# EAGLE design Gateway v2 (EAGLE 9.5.0)
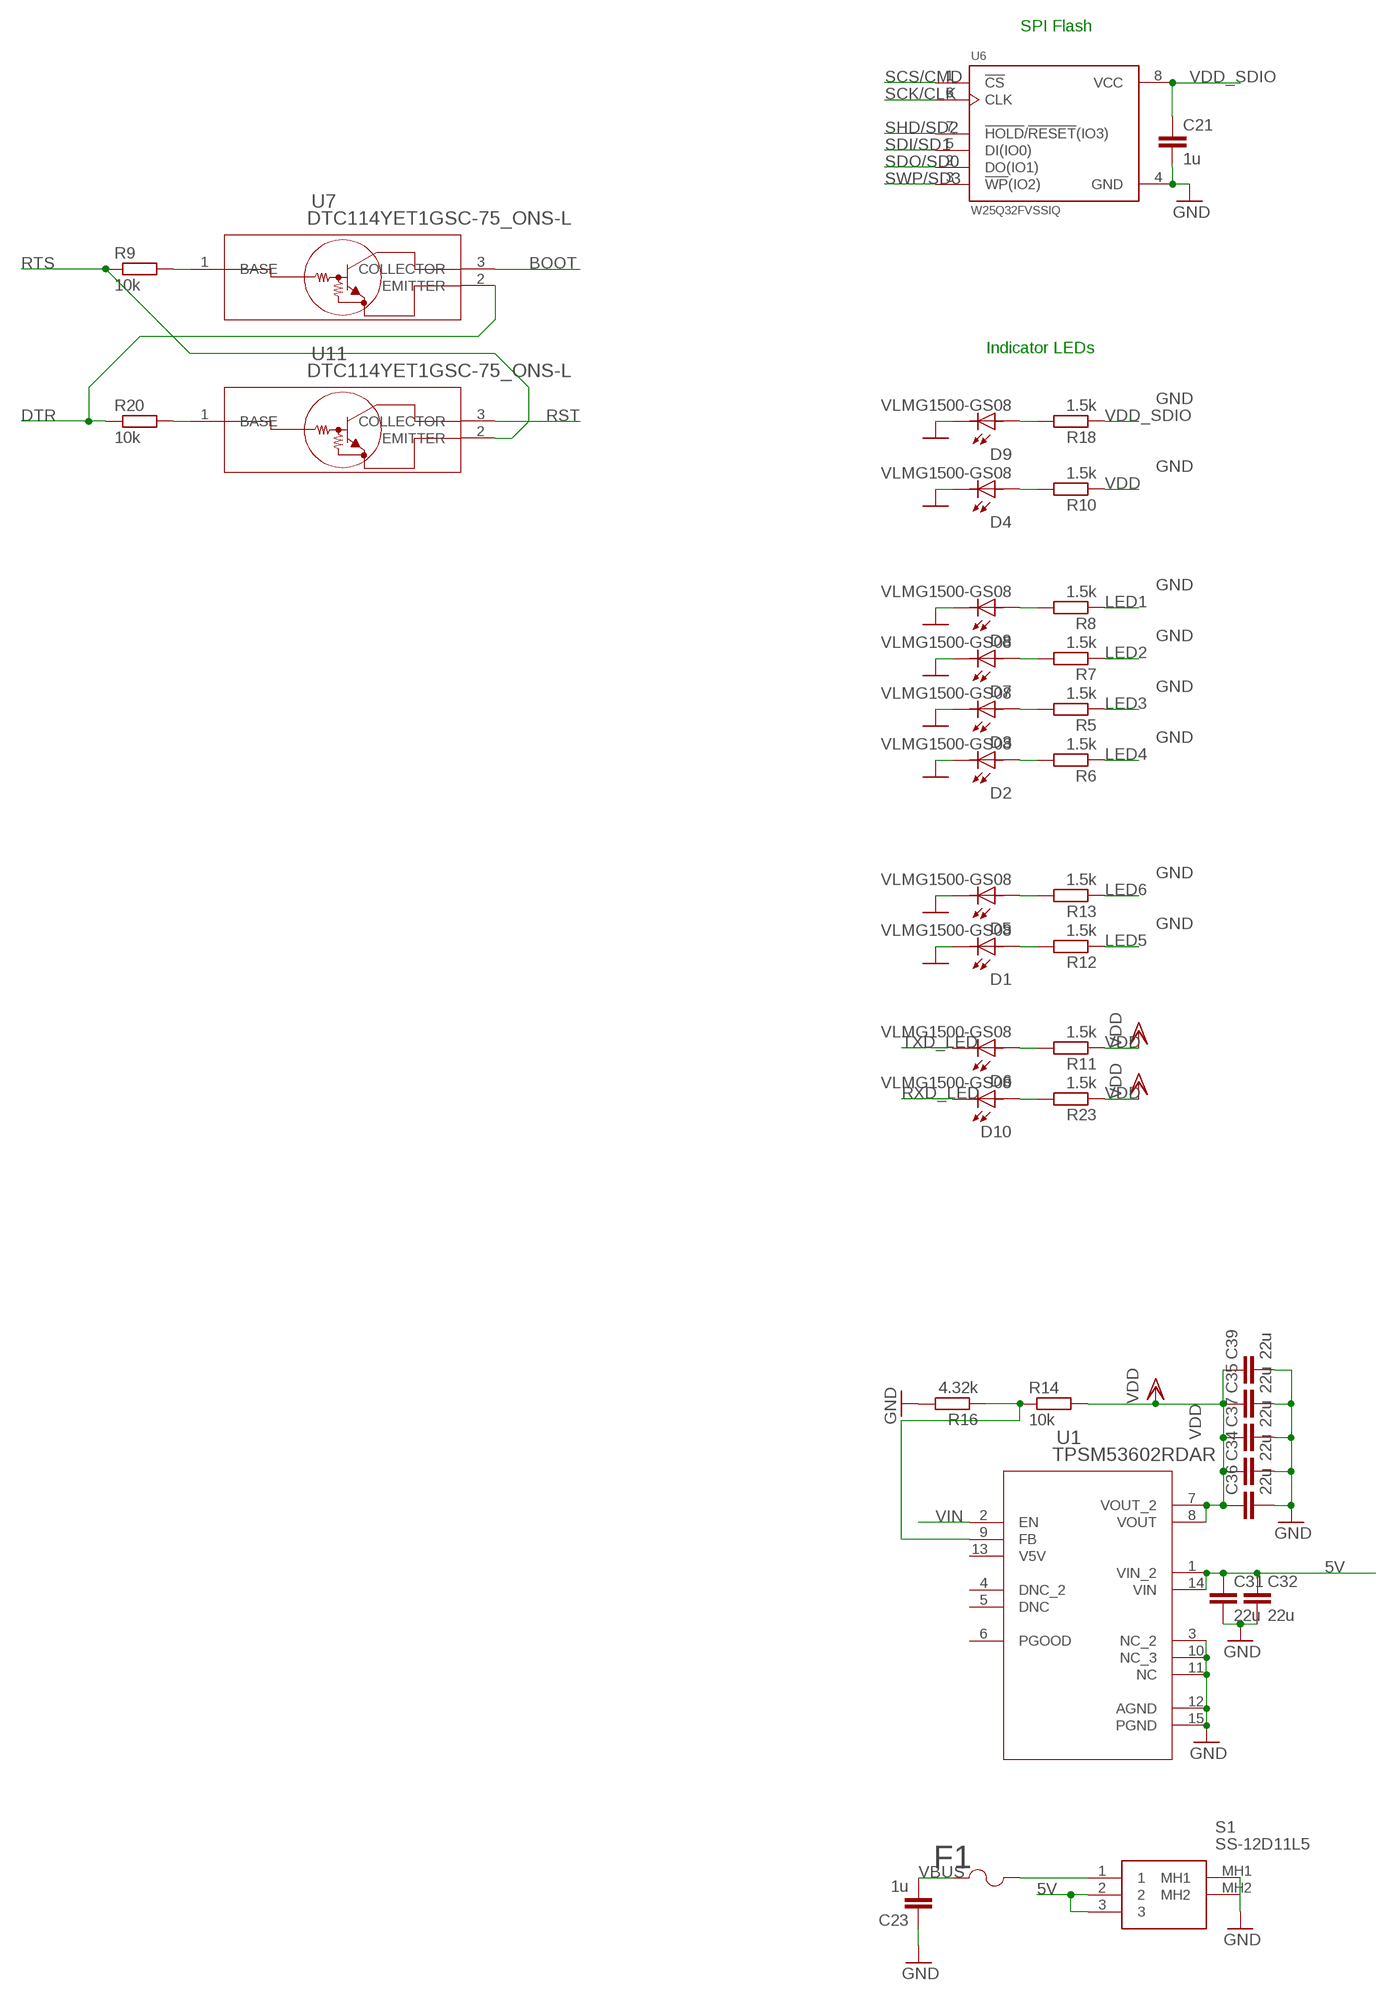
[diagram p0: schematic, sheet 1, part 1 of 2]
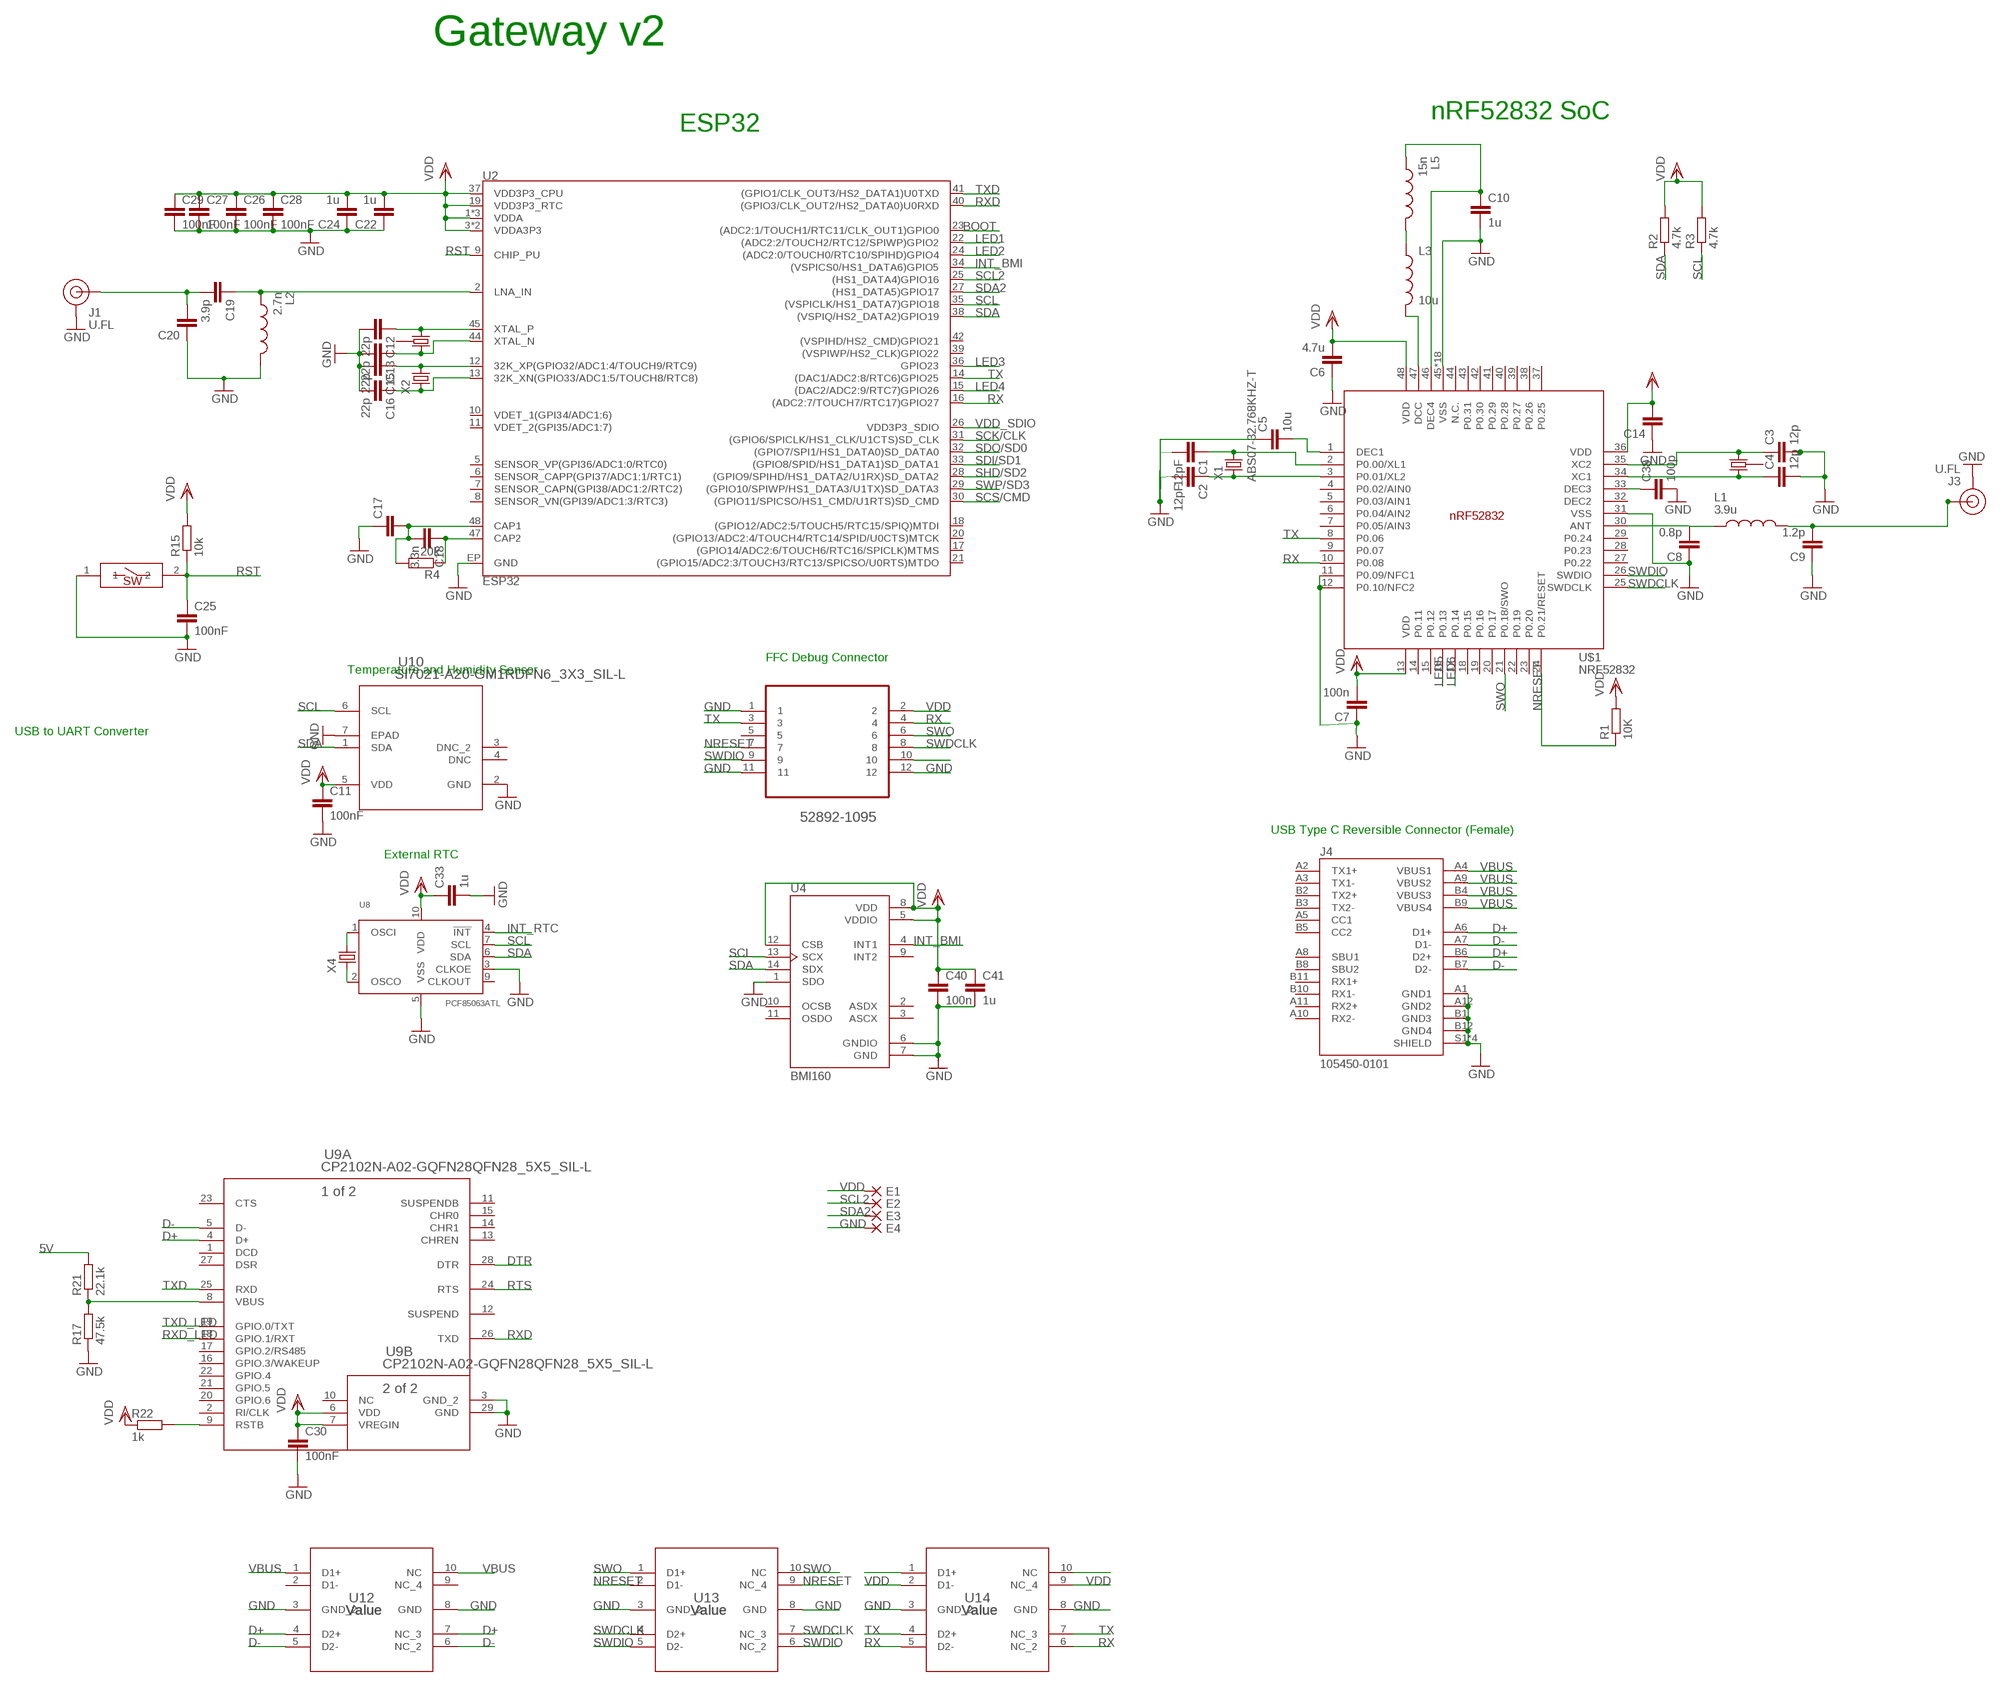
[diagram p1: schematic, sheet 1, part 2 of 2]

## Parts
C1  12pF  CC0402  [C0402]
C2  12pF  CC0402  [C0402]
C3  12p  CC0402  [C0402]
C4  12p  CC0402  [C0402]
C5  10u  CC0402  [C0402]
C6  4.7u  CC0402  [C0402]
C7  100n  CC0402  [C0402]
C8  0.8p  CC0402  [C0402]
C9  1.2p  CC0402  [C0402]
C10  1u  CC0402  [C0402]
C11  100nF  CC0402  [C0402]
C12  22p  CC0402  [C0402]
C13  22p  CC0402  [C0402]
C14  100u  CC0402  [C0402]
C15  22p  CC0402  [C0402]
C16  22p  CC0402  [C0402]
C17  10n  CC0402  [C0402]
C18  3.3n  CC0402  [C0402]
C19  3.9p  CC0402  [C0402]
C20  2.4p  CC0402  [C0402]
C21  1u  CC0402  [C0402]
C22  1u  CC0603R  [C0603R]
C23  1u  CC0603R  [C0603R]
C24  1u  CC0603R  [C0603R]
C25  100nF  CC0402  [C0402]
C26  100nF  CC0402  [C0402]
C27  100nF  CC0402  [C0402]
C28  100nF  CC0402  [C0402]
C29  100nF  CC0402  [C0402]
C30  100nF  CC0402  [C0402]
C31  22u  CC0603R  [C0603R]
C32  22u  CC0603R  [C0603R]
C33  1u  CC0603R  [C0603R]
C34  22u  CC0603R  [C0603R]
C35  22u  CC0603R  [C0603R]
C36  22u  CC0603R  [C0603R]
C37  22u  CC0603R  [C0603R]
C38  100p  CC0402  [C0402]
C39  22u  CC0603R  [C0603R]
C40  100n  CC0402  [C0402]
C41  1u  CC0402  [C0402]
D1  VLMG1500-GS08  [LEDC1005X35N]
D2  VLMG1500-GS08  [LEDC1005X35N]
D3  VLMG1500-GS08  [LEDC1005X35N]
D4  VLMG1500-GS08  [LEDC1005X35N]
D5  VLMG1500-GS08  [LEDC1005X35N]
D6  VLMG1500-GS08  [LEDC1005X35N]
D7  VLMG1500-GS08  [LEDC1005X35N]
D8  VLMG1500-GS08  [LEDC1005X35N]
D9  VLMG1500-GS08  [LEDC1005X35N]
D10  VLMG1500-GS08  [LEDC1005X35N]
E1  DPADS_PAD-0400-S  [DPADS_0400-S]
E2  DPADS_PAD-0400-S  [DPADS_0400-S]
E3  DPADS_PAD-0400-S  [DPADS_0400-S]
E4  DPADS_PAD-0400-S  [DPADS_0400-S]
F1  1210L050YR1210LSERIES_LTF-L  [1210LSERIES_LTF-L]
J1  U.FL  U.FL2PIN  [U.FL]
J3  U.FL  U.FL2PIN  [U.FL]
J4  105450-0101  [MOLEX_105450-0101]
L1  3.9u  MHQ0402P7N5JT000  [INDC0402X26N]
L2  2.7n  MHQ0402P7N5JT000  [INDC0402X26N]
L3  10u  INDUCTOR  [L0603]
L5  15n  MHQ0402P7N5JT000  [INDC0402X26N]
R1  10K  RR0402  [R0402]
R2  4.7k  RR0402  [R0402]
R3  4.7k  RR0402  [R0402]
R4  20k  RR0402  [R0402]
R5  1.5k  RR0402  [R0402]
R6  1.5k  RR0402  [R0402]
R7  1.5k  RR0402  [R0402]
R8  1.5k  RR0402  [R0402]
R9  10k  RR0402  [R0402]
R10  1.5k  RR0402  [R0402]
R11  1.5k  RR0402  [R0402]
R12  1.5k  RR0402  [R0402]
R13  1.5k  RR0402  [R0402]
R14  10k  RR0402  [R0402]
R15  10k  RR0402  [R0402]
R16  4.32k  RR0402  [R0402]
R17  47.5k  RR0402  [R0402]
R18  1.5k  RR0402  [R0402]
R20  10k  RR0402  [R0402]
R21  22.1k  RR0402  [R0402]
R22  1k  RR0402  [R0402]
R23  1.5k  RR0402  [R0402]
RESET  SMDSWITCH  [RESC4217X170]
S1  SS-12D11L5  [SS12D11L5]
U1  TPSM53602RDAR  [B3QFN15_RDA_TEX]
U2  ESP32  [QFN48-0.4MM]
U4  BMI160  [PQFN50P300X250X88-14N]
U5  52892-1095  [MOLEX_52892-1095]
U6  W25Q32FVSSIQ  [SOIC127P790X216-8N]
U7  DTC114YET1GSC-75_ONS-L  [SC-75_ONS-L]
U8  PCF85063ATL  [SOT1197-1]
U9  CP2102N-A02-GQFN28QFN28_5X5_SIL-L  [QFN28_5X5_SIL-L]
U10  SI7021-A20-GM1RDFN6_3X3_SIL-L  [DFN6_3X3_SIL-L]
U11  DTC114YET1GSC-75_ONS-L  [SC-75_ONS-L]
U12  Value  ESD204DQAR  [DQA0010A]
U13  Value  ESD204DQAR  [DQA0010A]
U14  Value  ESD204DQAR  [DQA0010A]
U$1  NRF52832  [QFN40P600X600X90-48_N]
X1  ABS07-32.768KHZ-T  [ABS07-32.768KHZ-T]
X2  ABS07-32.768KHZ-T  [ABS07-32.768KHZ-T]
X4  ABS07-32.768KHZ-T  [ABS07-32.768KHZ-T]
Y1  CRYSTAL-26MHZSMD-3.2X2.5  [CRYSTAL-SMD-3.2X2.5MM]
Y2  CRYSTAL-26MHZSMD-3.2X2.5  [CRYSTAL-SMD-3.2X2.5MM]

## Nets
5V: C31.1 C32.1 R21.2 S1.2 S1.3 U1.1(VIN_2) U1.14(VIN)
BOOT: U2.23((ADC2:1/TOUCH1/RTC11/CLK_OUT1)GPIO0) U7.3(COLLECTOR)
D+: J4.A6(D1+) J4.B6(D2+) U9.4(A:D+) U12.4(D2+) U12.7(NC_3)
D-: J4.A7(D1-) J4.B7(D2-) U9.5(A:D-) U12.5(D2-) U12.6(NC_2)
DTR: R20.1 U7.2(EMITTER) U9.28(A:DTR)
GND: C1.2 C2.2 C3.2 C4.2 C5.1 C6.1 C7.1 C8.1 C9.1 C10.2 C11.2 C12.2 C13.2 C14.1 C15.2 C16.2 C17.1 C20.1 C21.2 C22.1 C23.1 C24.1 C25.2 C26.2 C27.2 C28.2 C29.2 C30.2 C31.2 C32.2 C33.2 C34.2 C35.2 C36.2 C37.2 C38.2 C39.2 C40.2 C41.2 D1.2 D2.2 D3.2 D4.2 D5.2 D7.2 D8.2 D9.2 E4.PAD(P) J1.1(GND) J1.2(GND) J3.1(GND) J3.2(GND) J4.A1(GND1) J4.A12(GND2) J4.B1(GND3) J4.B12(GND4) J4.S1(SHIELD) J4.S2(SHIELD) J4.S3(SHIELD) J4.S4(SHIELD) L2.2 R16.2 R17.1 RESET.1 S1.MH1 S1.MH2 U1.3(NC_2) U1.10(NC_3) U1.11(NC) U1.12(AGND) U1.15(PGND) U2.EP(GND) U4.1(SDO) U4.6(GNDIO) U4.7(GND) U5.1 U5.11 U5.12 U6.4(GND) U8.3(CLKOE) U8.5(VSS) U9.3(B:GND_2) U9.29(B:GND) U10.2(GND) U10.7(EPAD) U12.3(GND_2) U12.8(GND) U13.3(GND_2) U13.8(GND) U14.3(GND_2) U14.8(GND) U$1.11(P0.09/NFC1) U$1.12(P0.10/NFC2) U$1.31(VSS) U$1.45(VSS) U$1.PAD(VSS) U$1.PAD@VIA01(VSS) U$1.PAD@VIA02(VSS) U$1.PAD@VIA03(VSS) U$1.PAD@VIA04(VSS) U$1.PAD@VIA05(VSS) U$1.PAD@VIA06(VSS) U$1.PAD@VIA07(VSS) U$1.PAD@VIA08(VSS) U$1.PAD@VIA09(VSS) U$1.PAD@VIA10(VSS) U$1.PAD@VIA11(VSS) U$1.PAD@VIA12(VSS) U$1.PAD@VIA13(VSS) U$1.PAD@VIA14(VSS) U$1.PAD@VIA15(VSS) U$1.PAD@VIA16(VSS)
INT_BMI: U2.34((VSPICS0/HS1_DATA6)GPIO5) U4.4(INT1)
INT_RTC: U8.4(!INT!)
LED1: R8.1 U2.22((ADC2:2/TOUCH2/RTC12/SPIWP)GPIO2)
LED2: R7.1 U2.24((ADC2:0/TOUCH0/RTC10/SPIHD)GPIO4)
LED3: R5.1 U2.36(GPIO23)
LED4: R6.1 U2.15((DAC2/ADC2:9/RTC7)GPIO26)
LED5: R12.1 U$1.16(P0.13)
LED6: R13.1 U$1.17(P0.14)
N$1: C1.1 U$1.2(P0.00/XL1) X1.2
N$2: C2.1 U$1.3(P0.01/XL2) X1.1
N$3: C3.1 U$1.35(XC2) Y1.3
N$4: C4.1 U$1.34(XC1) Y1.1
N$5: C5.2 U$1.1(DEC1)
N$6: C8.2 L1.1 U$1.30(ANT)
N$7: C13.1 U2.44(XTAL_N) Y2.3
N$8: C12.1 U2.45(XTAL_P) Y2.1
N$9: L3.2 U$1.47(DCC)
N$10: L3.1 L5.2
N$11: C10.1 L5.1 U$1.46(DEC4)
N$12: C15.1 U2.12(32K_XP(GPIO32/ADC1:4/TOUCH9/RTC9)) X2.2
N$13: C16.1 U2.13(32K_XN(GPIO33/ADC1:5/TOUCH8/RTC8)) X2.1
N$14: C18.1 R4.1 U2.47(CAP2)
N$15: C38.1 U$1.33(DEC3)
N$16: C17.2 C18.2 R4.2 U2.48(CAP1)
N$18: D3.1 R5.2
N$19: D7.1 R7.2
N$20: D8.1 R8.2
N$21: U5.10
N$22: C19.1 L2.1 U2.2(LNA_IN)
N$23: R17.2 R21.1 U9.8(A:VBUS)
N$24: D2.1 R6.2
N$25: D4.1 R10.2
N$26: D1.1 R12.2
N$27: D5.1 R13.2
N$28: C19.2 C20.2 J1.FEED(SIGNAL)
N$29: R20.2 U11.1(BASE)
N$30: R9.2 U7.1(BASE)
N$31: D9.1 R18.2
N$32: R14.1 R16.1 U1.9(FB)
N$33: U8.1(OSCI) X4.2
N$34: U8.2(OSCO) X4.1
N$35: R22.2 U9.9(A:RSTB)
N$36: D6.1 R11.2
N$37: D10.1 R23.2
N$38: F1.2 S1.1
N$47: U14.10(NC)
NRESET: R1.1 U5.7 U13.2(D1-) U13.9(NC_4) U$1.24(P0.21/RESET)
RFP1: C9.2 J3.FEED(SIGNAL) L1.2
RST: C25.1 R15.1 RESET.2 U2.9(CHIP_PU) U11.3(COLLECTOR)
RTS: R9.1 U9.24(A:RTS) U11.2(EMITTER)
RX: U2.16((ADC2:7/TOUCH7/RTC17)GPIO27) U5.4 U14.5(D2-) U14.6(NC_2) U$1.10(P0.08)
RXD: U2.40((GPIO3/CLK_OUT2/HS2_DATA0)U0RXD) U9.26(A:TXD)
RXD_LED: D10.2 U9.18(A:GPIO.1/RXT)
SCK/CLK: U2.31((GPIO6/SPICLK/HS1_CLK/U1CTS)SD_CLK) U6.6(CLK)
SCL: R3.1 U2.35((VSPICLK/HS1_DATA7)GPIO18) U4.13(SCX) U8.7(SCL) U10.6(SCL)
SCL2: E2.PAD(P) U2.25((HS1_DATA4)GPIO16)
SCS/CMD: U2.30((GPIO11/SPICSO/HS1_CMD/U1RTS)SD_CMD) U6.1(!CS)
SDA: R2.1 U2.38((VSPIQ/HS2_DATA2)GPIO19) U4.14(SDX) U8.6(SDA) U10.1(SDA)
SDA2: E3.PAD(P) U2.27((HS1_DATA5)GPIO17)
SDI/SD1: U2.33((GPIO8/SPID/HS1_DATA1)SD_DATA1) U6.5(DI(IO0))
SDO/SD0: U2.32((GPIO7/SPI1/HS1_DATA0)SD_DATA0) U6.2(DO(IO1))
SHD/SD2: U2.28((GPIO9/SPIHD/HS1_DATA2/U1RX)SD_DATA2) U6.7(!HOLD!/!RESET!(IO3))
SWDCLK: U5.8 U13.4(D2+) U13.7(NC_3) U$1.25(SWDCLK)
SWDCLK1: U14.1(D1+)
SWDIO: U5.9 U13.5(D2-) U13.6(NC_2) U$1.26(SWDIO)
SWO: U5.6 U13.1(D1+) U13.10(NC) U$1.21(P0.18/SWO)
SWP/SD3: U2.29((GPIO10/SPIWP/HS1_DATA3/U1TX)SD_DATA3) U6.3(!WP!(IO2))
TX: U2.14((DAC1/ADC2:8/RTC6)GPIO25) U5.3 U14.4(D2+) U14.7(NC_3) U$1.8(P0.06)
TXD: U2.41((GPIO1/CLK_OUT3/HS2_DATA1)U0TXD) U9.25(A:RXD)
TXD_LED: D6.2 U9.19(A:GPIO.0/TXT)
VBUS: C23.2 F1.1 J4.A4(VBUS1) J4.A9(VBUS2) J4.B4(VBUS3) J4.B9(VBUS4) U12.1(D1+) U12.10(NC)
VDD: C6.2 C7.2 C11.1 C14.2 C22.2 C24.2 C26.1 C27.1 C28.1 C29.1 C30.1 C33.1 C34.1 C35.1 C36.1 C37.1 C39.1 C40.1 C41.1 E1.PAD(P) R1.2 R2.2 R3.2 R10.1 R11.1 R14.2 R15.2 R22.1 R23.1 U1.7(VOUT_2) U1.8(VOUT) U2.1(VDDA) U2.3(VDDA3P3) U2.4(VDDA3P3) U2.19(VDD3P3_RTC) U2.37(VDD3P3_CPU) U2.43(VDDA) U2.46(VDDA) U4.5(VDDIO) U4.8(VDD) U4.12(CSB) U5.2 U8.10(VDD) U9.6(B:VDD) U9.7(B:VREGIN) U10.5(VDD) U14.2(D1-) U14.9(NC_4) U$1.13(VDD) U$1.36(VDD) U$1.48(VDD)
VDD_SDIO: C21.1 R18.1 U2.26(VDD3P3_SDIO) U6.8(VCC)
VIN: U1.2(EN)
Unconnected: J4.A2(TX1+) J4.A3(TX1-) J4.A5(CC1) J4.A8(SBU1) J4.A10(RX2-) J4.A11(RX2+) J4.B2(TX2+) J4.B3(TX2-) J4.B5(CC2) J4.B8(SBU2) J4.B10(RX1-) J4.B11(RX1+) U1.4(DNC_2) U1.5(DNC) U1.6(PGOOD) U1.13(V5V) U2.5(SENSOR_VP(GPI36/ADC1:0/RTC0)) U2.6(SENSOR_CAPP(GPI37/ADC1:1/RTC1)) U2.7(SENSOR_CAPN(GPI38/ADC1:2/RTC2)) U2.8(SENSOR_VN(GPI39/ADC1:3/RTC3)) U2.10(VDET_1(GPI34/ADC1:6)) U2.11(VDET_2(GPI35/ADC1:7)) U2.17((GPIO14/ADC2:6/TOUCH6/RTC16/SPICLK)MTMS) U2.18((GPIO12/ADC2:5/TOUCH5/RTC15/SPIQ)MTDI) U2.20((GPIO13/ADC2:4/TOUCH4/RTC14/SPID/U0CTS)MTCK) U2.21((GPIO15/ADC2:3/TOUCH3/RTC13/SPICSO/U0RTS)MTDO) U2.39((VSPIWP/HS2_CLK)GPIO22) U2.42((VSPIHD/HS2_CMD)GPIO21) U4.2(ASDX) U4.3(ASCX) U4.9(INT2) U4.10(OCSB) U4.11(OSDO) U5.5 U8.9(CLKOUT) U9.1(A:DCD) U9.2(A:RI/CLK) U9.10(B:NC) U9.11(A:SUSPENDB) U9.12(A:SUSPEND) U9.13(A:CHREN) U9.14(A:CHR1) U9.15(A:CHR0) U9.16(A:GPIO.3/WAKEUP) U9.17(A:GPIO.2/RS485) U9.20(A:GPIO.6) U9.21(A:GPIO.5) U9.22(A:GPIO.4) U9.23(A:CTS) U9.27(A:DSR) U10.3(DNC_2) U10.4(DNC) U12.2(D1-) U12.9(NC_4) U$1.4(P0.02/AIN0) U$1.5(P0.03/AIN1) U$1.6(P0.04/AIN2) U$1.7(P0.05/AIN3) U$1.9(P0.07) U$1.14(P0.11) U$1.15(P0.12) U$1.18(P0.15) U$1.19(P0.16) U$1.20(P0.17) U$1.22(P0.19) U$1.23(P0.20) U$1.27(P0.22) U$1.28(P0.23) U$1.29(P0.24) U$1.32(DEC2) U$1.37(P0.25) U$1.38(P0.26) U$1.39(P0.27) U$1.40(P0.28) U$1.41(P0.29) U$1.42(P0.30) U$1.43(P0.31) U$1.44(N.C.) Y1.2 Y1.4 Y2.2 Y2.4

## Notes on the sheet
- Gateway v2
- nRF52832 SoC
- ESP32
- SPI Flash
- Indicator LEDs
- FFC Debug Connector
- Temperature and Humidity Sensor
- USB to UART Converter
- USB Type C Reversible Connector (Female)
- External RTC

## Library data of the parts
C1-C21 C25-C30 C38 C40 C41 = eagle-ltspice:C: CAPACITOR, European symbol; SPICEMODEL: NONE; SPICEPREFIX: C
C22-C24 C31-C37 C39 = eagle-ltspice:C: CAPACITOR, European symbol
D1-D10 = VLMG1500-GS08:VLMG1500-GS08: 0402 GREEN 571nm 35MCD 65° Rectangle with Flat Top SMT LED; AVAILABILITY: Unavailable; DESCRIPTION: 0402 GREEN 571nm 35MCD 65° Rectangle with Flat Top SMT LED; MF: Vishay; MP: VLMG1500-GS08; PACKAGE: 0402 Vishay; PRICE: None
E1-E4 = 52101-101-REV-A:DPADS_PAD: WIRE PAD Standard US Drill Sizes and SMD pads; BOM: EXCLUDE
F1 = 1210 FUSE:1210L050YR; BUILT_BY: EMA_UL_Team; MANUFACTURER_PART_NUMBER: 1210L050YR; SOURCELIBRARY: LittleFuse_2015-04-13; VENDOR: Littelfuse Inc
J1 J3 = SparkFun-Connectors:U.FL2PIN: SMD Antenna Connector - U.FL 2mm height, 3.0mm x 3.0mm receptacle size. SparkFun Products: SparkFun WiFi Shield - ESP8266 <https://www.sparkfun.com/products/13287> SparkFun ESP8266 Thing <https://www.sparkfun.com/products/13231> SparkFun MiniGen - Pro Mini Signal Generator Shield <https://www.sparkfun.com/products/11420>; PROD_ID: CONN-09193; SF_ID: WRL-09144
J4 = 105450-0101:105450-0101: USB Shielded I/O Receptacle; Type C; Right Angle; Surface Mount; Gold over Nickel; AVAILABILITY: Unavailable; DESCRIPTION: USB-C (USB TYPE-C) USB 3.1 (USB 3.1 Gen 2, Superspeed+) Receptacle Connector 24 Position Surface Mount, Right Angle; Through Hole; MF: Molex; MP: 1054500101; PACKAGE: None; PRICE: None
L1 L2 L5 = MHQ0402P7N5JT000:MHQ0402P7N5JT000: 221 NH 5% GOLD TERMINAL; AVAILABILITY: Unavailable; DESCRIPTION: FIXED IND 7.5NH 200MA 1.2 OHM; MF: TDK; MP: MHQ0402P7N5JT000; PACKAGE: 0402 TDK; PRICE: None
L3 = BeagleBone_Blue_R3:INDUCTOR: Inductors Basic Inductor/Choke - 0603 and 1206. Footprints are not proven and vary greatly between part numbers. SRN6045- 33uH, 20% 1.4A
R1-R18 R20-R23 = eagle-ltspice:R: RESISTOR, European symbol; SPICEMODEL: NONE; SPICEPREFIX: R
RESET = SMD SWITCH:SMDSWITCH
S1 = SS-12D11L5:SS-12D11L5: Toggle Switches DIP RoHS Source: Datasheet <https://datasheet.lcsc.com/szlcsc/XKB-SS-12D11L5_C319010.pdf>; ARROW_PART_NUMBER: SS-12D11L5; DESCRIPTION: Toggle Switches DIP RoHS; HEIGHT: 6.9mm; MANUFACTURER_NAME: XKB Enterprise; MANUFACTURER_PART_NUMBER: SS-12D11L5
U1 = TPSM53602:TPSM53602RDAR; BUILT_BY: EMA_Cory; COPYRIGHT: Copyright (C) 2018 Accelerated Designs. All rights reserved; DATASHEET: https://www.ti.com/lit/ds/symlink/tpsm53602.pdf?ts=1593032137197&ref_url=https%253A%252F%252Fwww.ti.com%252Fstore%252Fti%252Fen%252Fp%252Fproduct%252F%253Fp%253DTPSM53602RDAR; MANUFACTURER_PART_NUMBER: TPSM53602RDAR; SOURCELIBRARY: TI_2020-06-27; VENDOR: Texas Instruments
U2 = SparkFun-RF:ESP32: Espressif ESP32 WiFi-compatible SoC microcontroller. Bluetooth Low energy support (BLE, BT4.0, Bluetooth Smart) 28 GPIO pins Dual-core Tensilica LX6 microprocessor Hardware accelerated encryption (AES, SHA2, ECC, RSA-4096) 4MB Flash memory 520kB internal SRAM Datasheet <https://cdn.sparkfun.com/datasheets/IoT/esp32_datasheet_en.pdf> SparkFun Products: SparkFun ESP32 Thing <https://www.sparkfun.com/products/13907>; PROD_ID: IC-13338
U4 = BMI160:BMI160: BMI160 2.5 x 3 mm Tiaxial Accelerometer / Gyroscope Inertial Measurement Unit; AVAILABILITY: Unavailable; DESCRIPTION: BMI160 2.5 x 3 mm Tiaxial Accelerometer / Gyroscope Inertial Measurement Unit; MF: Bosch; MP: BMI160; PACKAGE: LGA-14 Bosch; PRICE: None
U5 = 52892-1095:52892-1095: CONNECTOR, FPC, ZIF, 0.50MM, 10 WAY; AVAILABILITY: Unavailable; DESCRIPTION: Socket, r/a, Fpc, Zif, Smt, 10way; MF: Molex; MP: 52892-1095; PACKAGE: None; PRICE: None
U6 = W25Q32FVSSIQ:W25Q32FVSSIQ: NOR Flash Serial-SPI 3V/3.3V 32M-bit 4M x 8 8.5ns 8-Pin SOIC; AVAILABILITY: Unavailable; DESCRIPTION: Flash Serial-SPI 3V 32Mbit 32M x 1bit 7ns 8-Pin SOIC Bulk; MF: Winbond Electronics; MP: W25Q32FVSSIQ; PACKAGE: SOIC-8 Winbond; PRICE: None
U7 U11 = DTC114YET1G:DTC114YET1G; BUILT_BY: EMA_Justin; COPYRIGHT: Copyright (C) 2018 Accelerated Designs. All rights reserved; DATASHEET: https://www.onsemi.com/pub/Collateral/DTC114Y-D.PDF; MANUFACTURER_PART_NUMBER: DTC114YET1G; SOURCELIBRARY: ON_Semiconductor_2020-01-13; VENDOR: ON Semiconductor
U8 = PCF85063ATL:PCF85063ATL: Tiny Real-Time Clock/calendar with alarm function and I2C-bus The PCF85063A is a CMOS1 Real-Time Clock (RTC) and calendar optimized for low power consumption. An offset register allows fine-tuning of the clock. All addresses and data are transferred serially via the two-line bidirectional I2C-bus. Maximum data rate is 400 kbit/s. The register address is incremented automatically after each written or read data byte. AAL Eindhoven MK; AVAILABILITY: Unavailable; DESCRIPTION: Real Time Clock _RTC_ IC Clock/Calendar I²C, 2-Wire Serial 10-XFDFN Exposed Pad; MF: NXP USA; MP: PCF85063ATL; PACKAGE: DFN-10 NXP Semiconductors; PRICE: None
U9 = CP2102N:CP2102N-A02-GQFN28; BUILT_BY: EMA_Cory; COPYRIGHT: Copyright (C) 2018 Accelerated Designs. All rights reserved; DATASHEET: https://www.silabs.com/documents/public/data-sheets/cp2102n-datasheet.pdf; MANUFACTURER_PART_NUMBER: CP2102N-A02-GQFN28; SOURCELIBRARY: Silicon_Labs_2020-02-14; VENDOR: Silicon Labs
U10 = SI7021:SI7021-A20-GM1R; BUILT_BY: EMA_Jessica; COPYRIGHT: Copyright (C) 2018 Accelerated Designs. All rights reserved; MANUFACTURER_PART_NUMBER: SI7021-A20-GM1R; SOURCELIBRARY: Silicon_Labs_2020-01-01; VENDOR: Silicon Labs
U12-U14 = ESD204DQAR:ESD204DQAR; MANUFACTURER: Texas Instruments; PARTNUMBER: ESD204DQAR; REFDES: RefDes; TYPE: TYPE
U$1 = Nordic_nRF:NRF52832: nRF52832 Features Single chip, highly flexible, 2.4 GHz multi-protocol SoC 32-bit ARM Cortex-M4F Processor 1.7v to 3.6v operation 512kB flash + 64kB RAM Supports concurrent Bluetooth Smart/ANT protocol operation On-chip NFC tag for Out-of-Band (OOB) pairing Up to +4dBm output power -96dBm sensitivity, Bluetooth Smart Thread safe and run-time protected Event driven API On air compatible with nRF24L and nRF24AP series 2 data rates (2Mbps/1Mbps) PPI - maximum flexibility for power-efficient applications and code simplification Automated power management system with automatic power management of each peripheral Configurable I/O mapping for analog and digital I/O 3 x Master/Slave SPI 2 x Two-wire interface (I²C) UART (RTS/CTS) 3 x PWM AES HW encryption Real Time Counter (RTC) Digital microphone interface (PDM) On-chip balun Applications Internet of Things (IoT) Wearables SmartHome sensors Connected white goods Computer peripherals Voice-command smart remotes A4WP ‘Rezence’ wireless charging Beacons Sports and fitness sensors and hubs Connected health products Smart watches RC Toys Interactive games Building automation and sensor networks
X1 X2 X4 = Crystals:ABS07-32.768KHZ-T: CRYSTAL 32.7680KHZ 12.5PF SMD Manufacturer's datasheet <https://abracon.com/Resonators/ABS07.pdf>; CREATED_BY: PCBLayout.com; DIGIKEY_PART_NUMBER: 535-9542-2-ND; MANUFACTURER: Abracon LLC; MPN: ABS07-32.768KHZ-T; PACKAGE: SMD-2
Y1 Y2 = SparkFun-Clocks:CRYSTAL-26MHZ: 26MHz Crystal w/ Ground Pin Digikey Example <http://www.digikey.com/product-detail/en/epson/TSX-3225%2026.0000MF09Z-AC3/SER3627CT-ND/1802878> Frequency: 26MHz Frequency Stability: ±9ppm Frequency Tolerance: ±10ppm Load Capacitance: 9pF SparkFun Products: SparkFun ESP32 Thing <https://www.sparkfun.com/products/13907> SparkFun ESP8266 Thing Dev Board <https://www.sparkfun.com/products/13711>; PROD_ID: XTAL-12454

## Net classes
1 PWRINFL: width 0.381 mm, drill 0.305 mm, clearance 0.127 mm

## Board
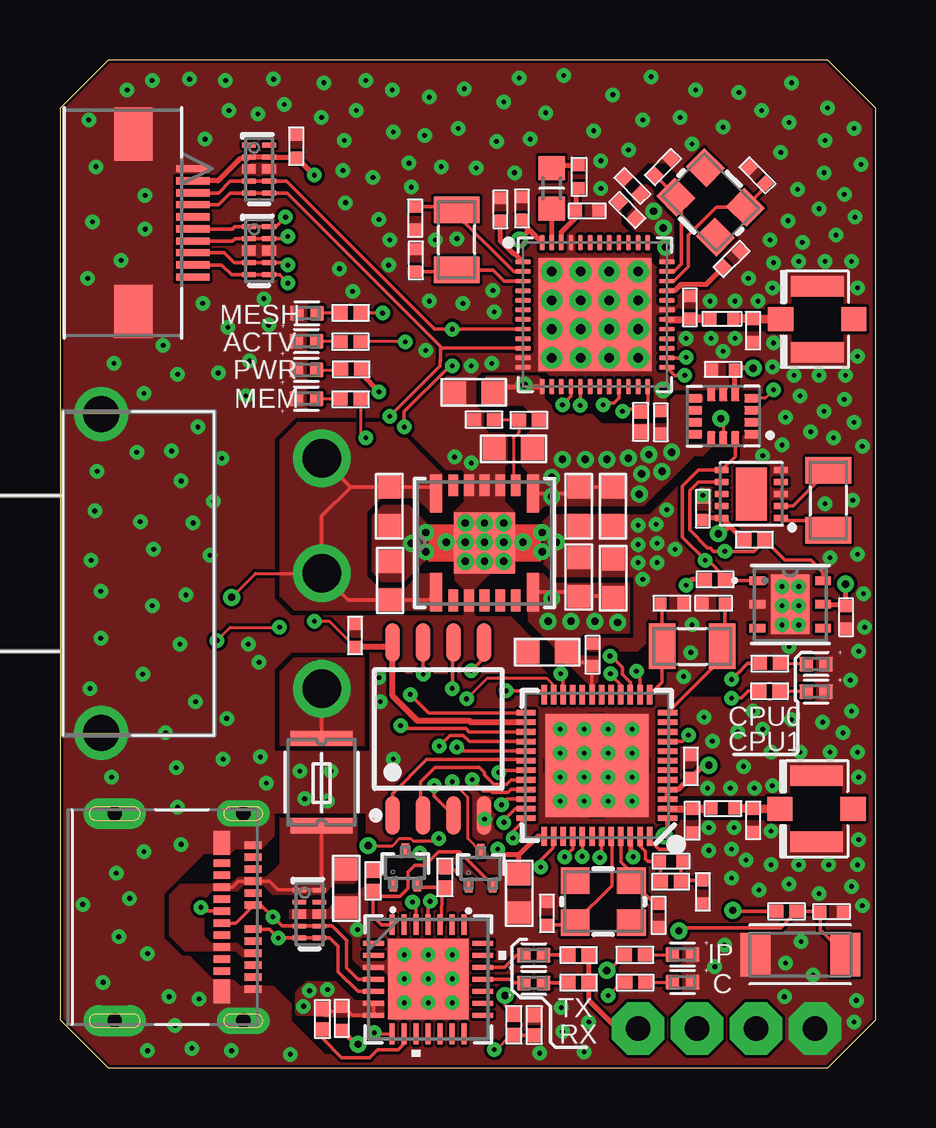
[diagram p2: board, top side]
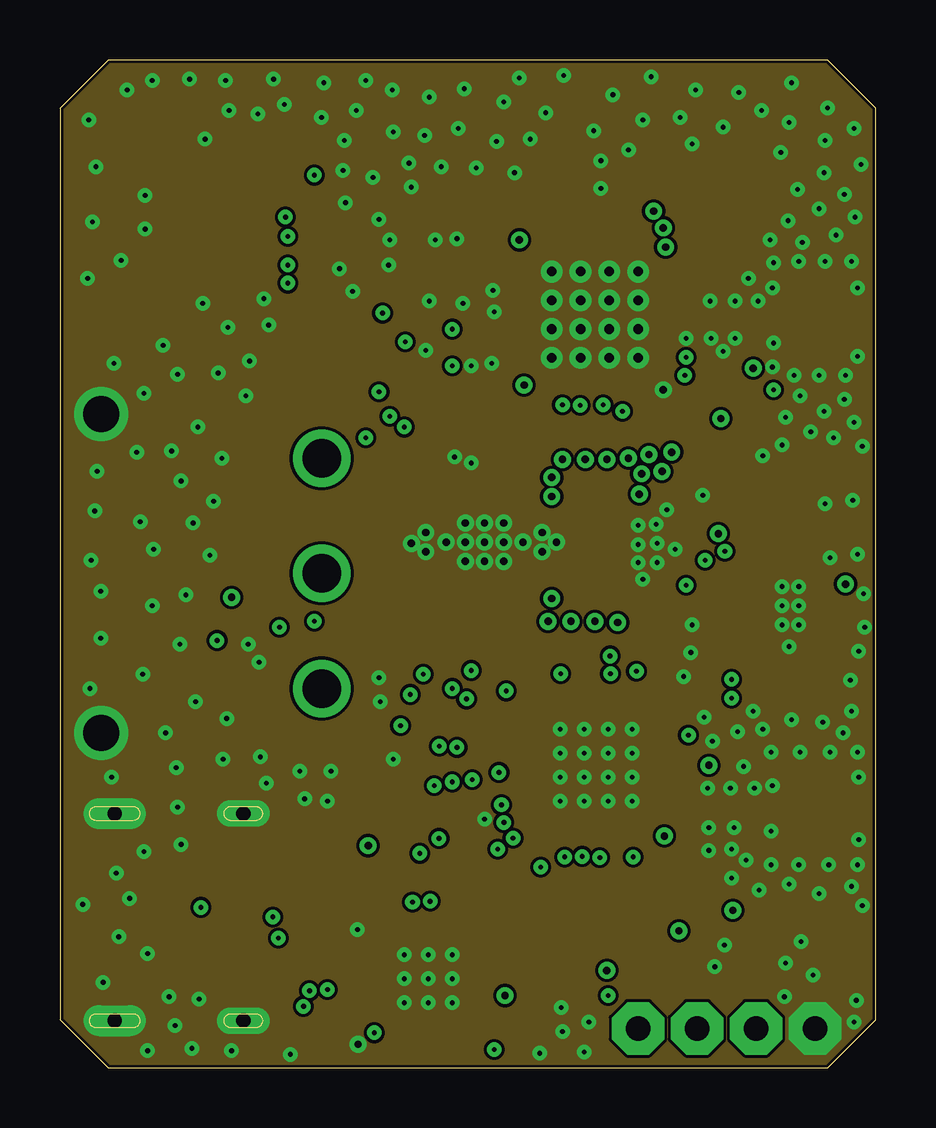
[diagram p3: board, inner layer Route2]
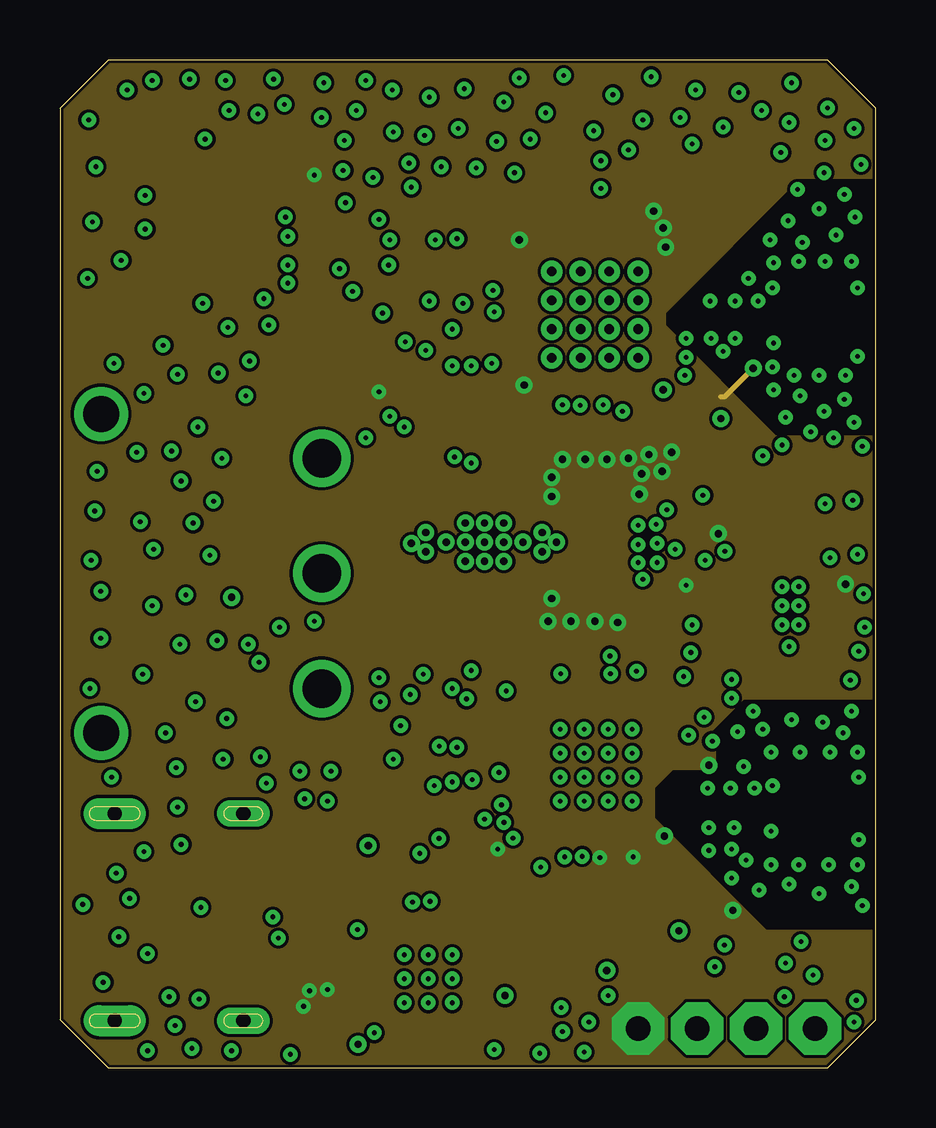
[diagram p4: board, inner layer Route15]
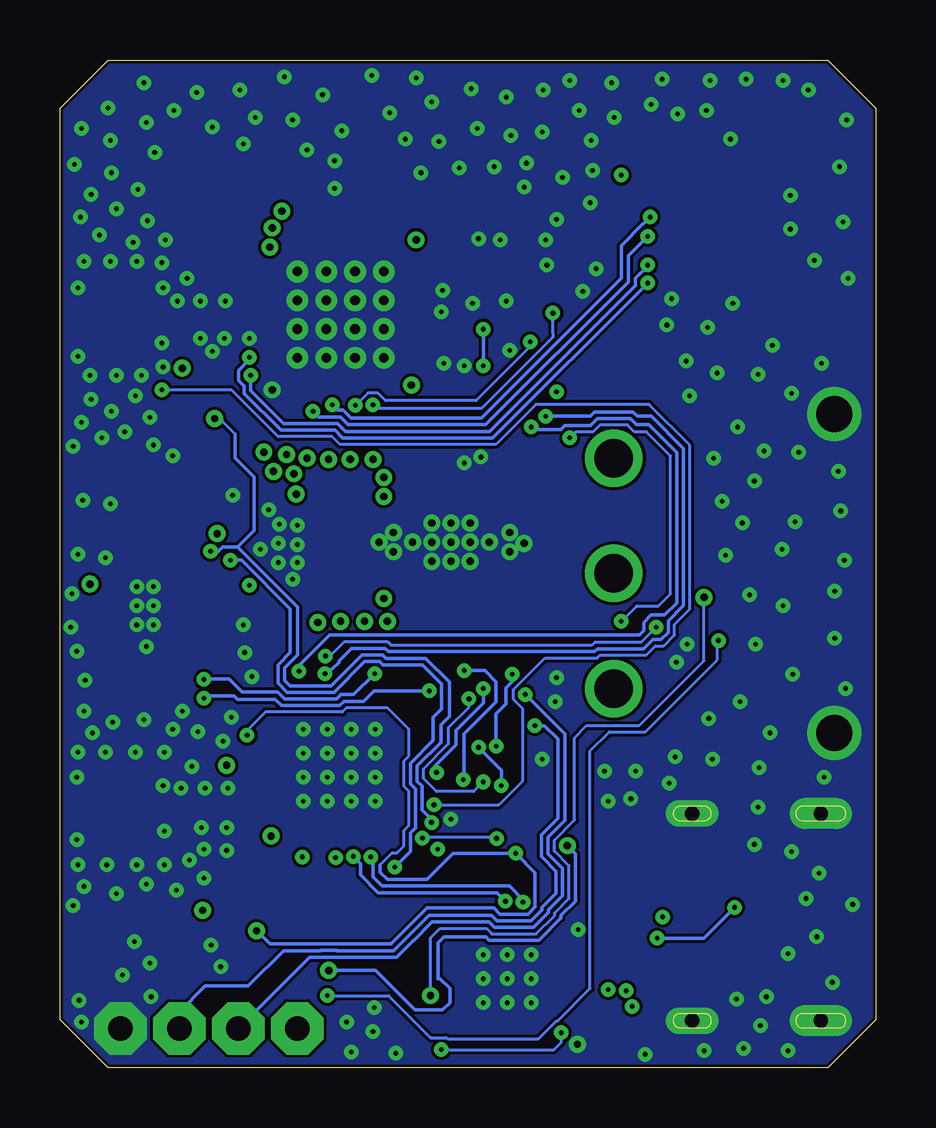
[diagram p5: board, bottom side, seen from below]

Size 34 x 42 mm. Coordinates in mm from the lower left corner, seen from the top.
Outline: 2,0 32,0 34,2 34,40 32,42 2,42 0,40 0,2 2,0
Copper layers (1+2*15+16): Top 0.035mm / dielectric 0.2mm / Route2 0.0175mm / dielectric 0.465mm / Route15 0.0175mm / dielectric 0.2mm / Bottom 0.035mm
Design rules "default *": minimum track width 5mil, minimum drill 0.2mm, track to track 5mil, track to pad 5mil, pad to pad 5mil, via to via 5mil, smd to smd 5mil, copper to edge 5mil, drill to drill 6mil, minimum pad ring 10mil, minimum via ring 8mil, stop-mask expansion 0mil, vias tented up to drill 40mil, thermal gap 0mil
tRestrict: area 20.9,5.5 to 24.4,8.3; area 24.9,33.9 to 29.3,38.3; area 30.5,30.2 to 32.6,32.1; area 30.4,9.9 to 32.6,11.8; 4 lines

### Footprints (pad centres in the part's own frame; a part is rotated, then mirrored left to right if it is on the bottom)
C0402 = smd 0.5 x 0.5: 1 -0.475,0; 2 0.475,0
C0603R = smd 0.95 x 0.95: 1 -0.85,0; 2 0.75,0
LEDC1005X35N = smd 0.59 x 0.61: 1 -0.415,0; 2 0.415,0
DPADS_0400-S = drill 1.016 pad 2.184 octagon: PAD 0,0
1210LSERIES_LTF-L = smd 0.635 x 2.591: 1 -1.816,0; 2 1.816,0
U.FL = smd 2.2 x 0.85: 1 0,1.375; 2 0,-1.375 | smd 1.05 x 1: FEED 1.525,0; NC -1.525,0
MOLEX_105450-0101 = smd 0.3 x 0.7: A1 -3,3.77; A2 -2.5,3.77; A3 -2,3.77; A4 -1.5,3.77; A5 -1,3.77; A6 -0.5,3.77; A7 0.5,3.77; A8 1,3.77; A9 1.5,3.77; A10 2,3.77; A11 2.5,3.77; A12 3,3.77; B2 2.25,2.47; B3 1.75,2.47; B4 1.25,2.47; B5 0.75,2.47; B6 0.25,2.47; B7 -0.25,2.47; B8 -0.75,2.47; B9 -1.25,2.47; B10 -1.75,2.47; B11 -2.25,2.47 | smd 1 x 0.7: B1 3.1,2.47; B12 -3.1,2.47 | drill 0.6 pad 1.1 long: S1 -4.32,3.36; S2 4.32,3.36 | drill 0.6 pad 1.3 long: S3 -4.32,-2; S4 4.32,-2
INDC0402X26N = smd 0.5 x 0.5: 1 -0.732,0; 2 0.232,0
L0603 = smd 1 x 1.1: 1 -0.85,0; 2 0.85,0
R0402 = smd 0.6 x 0.55: 1 -0.425,0; 2 0.425,0
RESC4217X170 = smd 1.254 x 1.829: 1 -1.875,0; 2 1.875,0
SS12D11L5 = drill 1.6 pad 2.4: 1 0,0; 2 4.8,0; 3 9.6,0 | drill 1.5 pad 2.25: MH1 -1.85,9.2; MH2 11.45,9.2
B3QFN15_RDA_TEX = smd 1.6 x 0.508: 1 -2.057,2.025; 7 -2.057,-2.025; 8 2.057,-2.025; 14 2.057,2.025 | smd 0.914 x 0.406: 2 -2.4,1.3; 3 -2.4,0.65; 4 -2.4,0; 5 -2.4,-0.65; 6 -2.4,-1.3; 9 2.4,-1.3; 10 2.4,-0.65; 11 2.4,0; 12 2.4,0.65; 13 2.4,1.3 | smd 2.54 x 2.54: 15 0,0
QFN48-0.4MM = smd 0.8 x 0.23: 1 -2.95,2.2; 2 -2.95,1.8; 3 -2.95,1.4; 4 -2.95,1; 5 -2.95,0.6; 6 -2.95,0.2; 7 -2.95,-0.2; 8 -2.95,-0.6; 9 -2.95,-1; 10 -2.95,-1.4; 11 -2.95,-1.8; 12 -2.95,-2.2; 25 2.95,-2.2; 26 2.95,-1.8; 27 2.95,-1.4; 28 2.95,-1; 29 2.95,-0.6; 30 2.95,-0.2; 31 2.95,0.2; 32 2.95,0.6; 33 2.95,1; 34 2.95,1.4; 35 2.95,1.8; 36 2.95,2.2 | smd 0.23 x 0.8: 13 -2.2,-2.95; 14 -1.8,-2.95; 15 -1.4,-2.95; 16 -1,-2.95; 17 -0.6,-2.95; 18 -0.2,-2.95; 19 0.2,-2.95; 20 0.6,-2.95; 21 1,-2.95; 22 1.4,-2.95; 23 1.8,-2.95; 24 2.2,-2.95; 37 2.2,2.95; 38 1.8,2.95; 39 1.4,2.95; 40 1,2.95; 41 0.6,2.95; 42 0.2,2.95; 43 -0.2,2.95; 44 -0.6,2.95; 45 -1,2.95; 46 -1.4,2.95; 47 -1.8,2.95; 48 -2.2,2.95 | smd 4.3 x 4.3: EP 0,0
PQFN50P300X250X88-14N = smd 0.59 x 0.35: 1 -1.165,0.75; 2 -1.165,0.25; 3 -1.165,-0.25; 4 -1.165,-0.75; 8 1.165,-0.75; 9 1.165,-0.25; 10 1.165,0.25; 11 1.165,0.75 | smd 0.35 x 0.59: 5 -0.5,-0.915; 6 0,-0.915; 7 0.5,-0.915; 12 0.5,0.915; 13 0,0.915; 14 -0.5,0.915
MOLEX_52892-1095 = smd 0.305 x 1.397: 1 2.261,2.896; 2 1.753,2.896; 3 1.245,2.896; 4 0.762,2.896; 5 0.254,2.896; 6 -0.254,2.896; 7 -0.762,2.896; 8 -1.245,2.896; 9 -1.753,2.896; 10 -2.261,2.896 | smd 2.21 x 1.6: 11 -3.702,5.359; 12 3.702,5.359
SOIC127P790X216-8N = smd 1.6 x 0.6: 1 -3.6,1.905; 2 -3.6,0.635; 3 -3.6,-0.635; 4 -3.6,-1.905; 5 3.6,-1.905; 6 3.6,-0.635; 7 3.6,0.635; 8 3.6,1.905
SC-75_ONS-L = smd 0.305 x 0.61: 1 -0.5,-0.699; 2 0.5,-0.699; 3 0,0.699
SOT1197-1 = smd 0.25 x 0.575: 1 -1,-1.238; 2 -0.5,-1.238; 3 0,-1.238; 4 0.5,-1.238; 5 1,-1.238; 6 1,1.238; 7 0.5,1.238; 8 0,1.238; 9 -0.5,1.238; 10 -1,1.238 | smd 2.2 x 1.3: CP 0,0
QFN28_5X5_SIL-L = smd 0.864 x 0.203: 1 -2.273,1.5; 2 -2.273,1; 3 -2.273,0.5; 4 -2.273,0; 5 -2.273,-0.5; 6 -2.273,-1; 7 -2.273,-1.5; 15 2.273,-1.5; 16 2.273,-1; 17 2.273,-0.5; 18 2.273,0; 19 2.273,0.5; 20 2.273,1; 21 2.273,1.5 | smd 0.203 x 0.864: 8 -1.5,-2.273; 9 -1,-2.273; 10 -0.5,-2.273; 11 0,-2.273; 12 0.5,-2.273; 13 1,-2.273; 14 1.5,-2.273; 22 1.5,2.273; 23 1,2.273; 24 0.5,2.273; 25 0,2.273; 26 -0.5,2.273; 27 -1,2.273; 28 -1.5,2.273 | smd 3.353 x 3.353: 29 0,0
DFN6_3X3_SIL-L = smd 0.66 x 0.356: 1 -1.372,0.991; 2 -1.372,0; 3 -1.372,-0.991; 4 1.372,-0.991; 5 1.372,0; 6 1.372,0.991 | smd 1.6 x 2.489: 7 0,0
DQA0010A = smd 0.565 x 0.2: 1 -0.417,1; 2 -0.417,0.5; 4 -0.417,-0.5; 5 -0.417,-1; 6 0.417,-1; 7 0.417,-0.5; 9 0.417,0.5; 10 0.417,1 | smd 0.565 x 0.4: 3 -0.417,0; 8 0.417,0
QFN40P600X600X90-48_N = smd 0.65 x 0.2: 1 -3,2.2; 2 -3,1.8; 3 -3,1.4; 4 -3,1; 5 -3,0.6; 6 -3,0.2; 7 -3,-0.2; 8 -3,-0.6; 9 -3,-1; 10 -3,-1.4; 11 -3,-1.8; 12 -3,-2.2; 25 3,-2.2; 26 3,-1.8; 27 3,-1.4; 28 3,-1; 29 3,-0.6; 30 3,-0.2; 31 3,0.2; 32 3,0.6; 33 3,1; 34 3,1.4; 35 3,1.8; 36 3,2.2 | smd 0.2 x 0.65: 13 -2.2,-3; 14 -1.8,-3; 15 -1.4,-3; 16 -1,-3; 17 -0.6,-3; 18 -0.2,-3; 19 0.2,-3; 20 0.6,-3; 21 1,-3; 22 1.4,-3; 23 1.8,-3; 24 2.2,-3; 37 2.2,3; 38 1.8,3; 39 1.4,3; 40 1,3; 41 0.6,3; 42 0.2,3; 43 -0.2,3; 44 -0.6,3; 45 -1,3; 46 -1.4,3; 47 -1.8,3; 48 -2.2,3 | smd 4.7 x 4.7: PAD 0,0 | drill 0.4: PAD@VIA01 -1.8,1.8; PAD@VIA02 -1.8,0.6; PAD@VIA03 -1.8,-0.6; PAD@VIA04 -1.8,-1.8; PAD@VIA05 -0.6,1.8; PAD@VIA06 -0.6,0.6; PAD@VIA07 -0.6,-0.6; PAD@VIA08 -0.6,-1.8; PAD@VIA09 0.6,1.8; PAD@VIA10 0.6,0.6; PAD@VIA11 0.6,-0.6; PAD@VIA12 0.6,-1.8; PAD@VIA13 1.8,1.8; PAD@VIA14 1.8,0.6; PAD@VIA15 1.8,-0.6; PAD@VIA16 1.8,-1.8
ABS07-32.768KHZ-T = smd 1.1 x 1.9: 1 -1.25,0; 2 1.25,0
CRYSTAL-SMD-3.2X2.5MM = smd 1.2 x 1.1: 1 -1.175,-0.875; 2 1.175,-0.875; 3 1.175,0.875; 4 -1.175,0.875

### Placement (x,y rotation side)
C1  14.81,35.41 270 top
C2  14.84,33.65 90 top
C3  25.14,37.54 45 top
C4  29.08,37.19 135 top
C5  18.36,35.77 270 top
C6  19.26,35.81 270 top
C7  23.65,35.74 315 top
C8  26.26,31.69 270 top
C9  28.89,30.72 90 top
C10  21.98,35.71 0 top
C11  32.77,18.77 270 top
C12  24.96,6.35 270 top
C13  20.3,6.43 90 top
C14  22.2,17.21 270 top
C15  27.25,19.35 180 top
C16  25.51,19.35 0 top
C17  26.8,7.32 90 top
C18  25.48,8.6 0 top
C19  27.64,10.8 0 top
C20  28.9,10.3 90 top
C21  12.3,18.01 90 top
C22  20.36,17.32 0 top
C23  11.93,7.52 90 top
C24  19.14,7.31 90 top
C25  32.17,6.5 0 top
C26  23.87,36.75 135 top
C27  26.8,23.29 90 top
C28  26.3,12.55 90 top
C29  9.85,38.41 90 top
C30  11.75,2.05 270 top
C31  13.73,23.35 270 top
C32  13.76,20.35 90 top
C33  17.2,28.14 180 top
C34  23.06,20.45 90 top
C35  18.85,25.8 180 top
C36  21.63,20.5 90 top
C37  21.63,23.35 270 top
C38  28,33.7 45 top
C39  23.05,23.35 270 top
C40  27.65,29.1 180 top
C41  25.05,26.9 90 top
D1  10.3,31.44 180 top
D2  25.95,3.56 0 top
D3  25.95,4.71 0 top
D4  10.28,29.08 180 top
D5  10.28,30.28 180 top
D6  19.75,4.68 180 top
D7  31.52,15.67 0 top
D8  31.52,16.82 0 top
D9  10.28,27.88 180 top
D10  19.75,3.53 180 top
E1  24.1,1.63 90 top
E2  26.56,1.63 90 top
E3  29.02,1.63 90 top
E4  31.48,1.63 90 top
F1  10.9,11.9 90 top
J1  31.54,10.79 180 top
J3  31.57,31.19 180 top
J4  4.28,6.27 270 top
L1  27.85,31.21 0 top
L2  26.36,10.04 270 top
L3  20.5,36.65 270 top
L5  21.64,37.38 90 top
R1  24.2,26.92 270 top
R2  27.31,20.35 180 top
R3  28.95,22 180 top
R4  25.46,7.75 0 top
R5  23.97,4.7 0 top
R6  23.98,3.55 0 top
R7  29.58,15.69 0 top
R8  29.59,16.84 0 top
R9  16.04,7.93 90 top
R10  12.14,29.11 180 top
R11  21.62,4.69 180 top
R12  12.12,31.46 180 top
R13  12.11,30.26 180 top
R14  19.55,26.99 0 top
R15  30.29,6.51 180 top
R16  17.68,27.01 180 top
R17  19.77,1.77 270 top
R18  12.12,27.86 180 top
R20  13.05,7.78 90 top
R21  18.92,1.78 90 top
R22  10.94,2.02 270 top
R23  21.62,3.54 180 top
RESET  30.86,4.71 0 top
S1  10.91,15.8 90 top
U1  17.7,21.87 90 top
U2  22.38,12.59 180 top
U4  27.65,27.15 180 top
U5  8.43,35.21 90 top
U6  15.77,14.11 90 top
U7  17.54,8.31 0 top
U8  28.82,23.91 90 top
U9  15.35,3.68 0 top
U10  30.44,19.31 0 top
U11  14.39,8.35 0 top
U12  10.4,6.4 0 top
U13  8.3,34.05 0 top
U14  8.3,37.45 0 top
U$1  22.3,31.38 0 top
X1  16.54,34.5 90 top
X2  26.35,17.56 0 top
X4  32.03,23.64 270 top
Y1  27.12,36.07 135 top
Y2  22.65,6.92 180 top

### Tracks (layer width: path | path; a pad name or v marks a point on that pad's centre or on a via)
5V  (via drill 0.3)
  Top 0.127: R21.2 18.55,2.58 v18.55,3 | v7.15,19.6 8.15,20.6 S1.2
  Top 0.15: U1.1 15.36,19.5 C32.1 12.01,19.5 S1.2 10.91,22.98 12.13,24.2 C31.1 | C31.1 15.4,24.2 U1.14 | C31.1 12.11,24.2 S1.3
  Bottom 0.127: v18.55,3 18.55,5.4 18.15,5.8 16.22,5.8 16,5.57 14.15,5.57 13.37,6.35 13.37,6.45 12.78,7.04 12.78,8.41 13.39,9.03 13.39,9.47 12.55,10.32 12.55,13.75 12.05,14.25 9.85,14.25 7.15,16.95 v7.15,19.6
  pour Top: 15.9,19.05 9.75,19.05 9.15,19.65 9.15,26.15 9.9,26.9 13.8,26.9 15.95,24.75 15.95,23.2 15.9,23.15 15.45,23.15 14.85,23.75 13.4,23.75 12.8,23.15 12.8,20.5 13.3,20 14.4,20 15,20.6 15.9,20.6
BOOT  (via drill 0.2)
  Top 0.127: v16.95,15.37 17.82,16.23 20.27,16.23 20.59,15.92 20.59,15.57 20.6,15.56 | v16.35,11.91 17,11.26 17,9.55 U7.3
  Top 0.15: 20.6,15.56 U2.23
  Bottom 0.127: v16.35,11.91 16.75,11.51 18.3,11.51 18.84,12.05 18.84,12.46 17.8,13.5 17.8,14.17 16.95,15.02 v16.95,15.37
D+  (via drill 0.2)
  Top 0.15: v8.88,6.28 8.38,6.77 J4.A6 8.05,6.75 7.32,6.02 J4.B6 | U9.4 12.42,3.68 11.95,4.15 11.95,5.3 11.35,5.9 U12.7 U12.4 9.25,5.9 v8.88,6.28 | v8.88,6.28
D-  (via drill 0.2)
  Top 0.15: U9.5 12.42,3.18 11.6,4 11.6,5.05 11.25,5.4 U12.6 U12.5 v9.1,5.4 | J4.A7 8.73,5.77 v9.1,5.4 | v9.1,5.4 | v9.1,5.4 v9.1,5.39 | v5.88,6.67 6.03,6.53 6.46,6.53 6.47,6.52 J4.B7
  Bottom 0.15: v9.1,5.39 7.16,5.39 v5.88,6.67
DTR
  Top 0.15: U7.2 16.65,9 15.79,9 15.21,8.43 14.78,8.43 14.5,8.15 14.5,7.47 14.18,7.14 13.26,7.14 R20.1 13.05,6.3 13.4,5.95 U9.28
GND  (via drill 0.2, 0.3)
  Top 0.2: v12.42,0.97 12.35,0.97 C30.2
  other vias: 28.7,32.9 30.6,28.85 29.75,30.2 29.7,32.5 11.8,37.4 10.9,39.6 31.9,38.65 31.85,37.3 5.4,41.2 18.1,31.5 30.05,38.15 32.7,36.4 31.85,27.35 30.8,33.6 29.6,34.5 31.65,28.85 20.95,1.5 16.45,25.45 18.05,32.4 33.1,39.15 20.9,2.5 26.35,18.45 7.05,39.9 32,40 28.15,30.4 27.15,30.4 28.15,31.95 29.1,31.95 30.4,17.55 2.8,40.75 3.85,41.15 33.4,37.65 26.3,17.3 32.35,34.7 33.15,35.45 30.75,36.6 30.1,25.95 30.25,27.1 33.25,29.65 27.1,31.95 31.8,14.4 5.5,0.8 8.9,41.2 9.35,40.15 32.1,21.25 26,16.3 17.15,29.25 18,29.35 23.85,13.1 24.9,21.05 25.3,23.25 32.25,26.25 28.95,11.65 32.1,13.15 22.05,1.9 14.35,4.7 29.65,13.15 33.5,19.75 22.85,12.1 23.85,11.1 26.1,30.4 29.65,9.85 27.95,11.65 27.05,10 33.25,13.15 16.35,2.7 15.35,3.7 16.35,4.7 21.85,14.1 24.1,21.8 24.1,21.05 25.65,21.6 14.35,3.7 30.85,13.15 33.55,18.35 20.85,11.1 33.25,8.45 30.8,8.45 33.25,21.4 23.85,12.1 20.85,14.1 22.85,14.1 24.9,21.85 15.35,2.7 16.35,3.7 27,11.65 14.35,2.7 22.85,11.1 15.35,4.7 29.7,11.75 16.55,34.55 28.3,40.65 26.35,38.5 16.8,31.85 8.25,39.75 19.15,41.25 17.35,37.5 6.05,38.7 11.65,33.3 33.1,1.9 13.05,37.1 30.9,5.25 30.5,41.05 26.5,40.75 18.5,40.25 31.4,3.85 29.25,39.9 16.85,40.8 16.6,39.15 27.7,5.1 13.9,39 1.2,39.5 6.9,41.15 27.65,39.2 15.9,37.55 11.85,38.65 12.2,32.35 27.3,4.2 9.6,0.55 31.65,7.25 33.2,2.8 25.85,39.6 11,41.05 28,9.1 33,7.55 18.95,37.3 13.85,40.75 33,14.85 28.5,12.55 27.2,13.6 33.45,6.75 30.4,7.65 33.3,17.35 30.5,14.5 28.9,14.85 29.15,7.4 28.25,14 32.65,13.95 15.25,22.3 16.9,21.9 17.7,21.9 16.1,21.9 16.9,21.1 18.5,21.1 17.7,21.1 16.9,22.7 18.5,22.7 17.7,22.7 19.3,21.9 18.5,21.9 20.1,21.5 20.1,22.3 15.25,21.5 20.85,13.1 21.85,12.1 32.05,8.45 29.65,8.45 21.85,11.1 33.3,12.1 28.1,10 33.45,25.9 20.85,12.1 21.85,13.1 23.85,14.1 33.3,9.5 33.1,26.9 32.75,28.85 29.7,29.2 29.75,33.55 30.85,28 32.7,27.85 30.35,35.3 33.25,32.5 32.95,16.15 29.3,14.1 26.85,14.6 29.3,25.5 33.05,23.65 31.9,23.5 30.4,39.4 22.85,13.1 24.1,22.6 24.85,22.65 31.3,26.5 30.95,34.4 31.65,35.8 33,33.6 31.9,33.6 15.65,34.5 28.6,8.65 19.6,38.7 15.2,38.85 15.4,40.45 27.05,9.05 14.55,37.7 12.75,41.15 28,7.9 21.85,0.65 12.35,39.9 13.7,33.45 1.35,35.25 1.15,32.9 3.2,25.65 1.5,37.55 2.25,29.35 6.75,25.4 3.9,21.6 7.9,29.45 3.55,34.95 3.55,36.35 5.95,31.85 7,30.85 5.75,26.7 4.3,30.1 5.05,24.45 3.5,28.1 2.55,33.65 1.45,23.2 1.3,21.15 15.25,29.9 6.6,28.95 8.5,32.05 4.9,28.9 1.55,24.85 4.65,25.7 24.3,39.5 21,41.35 13.3,35.35 7.75,28 15.4,31.95 30.2,2.95 22.25,39.05 20.25,39.8 18.2,38.6 13.75,34.5 23.05,40.55 24.65,41.3 23.7,38.25 11.9,36.05 8.7,30.95 7.15,0.7 5.8,2.85 1.7,17.9 5.25,19.7 2.15,12.1 6.25,21.35 0.95,6.8 2.45,5.45 3.35,22.75 5.55,22.7 3.85,19.25 6.4,23.6 4.85,12.5 1.25,15.8 3.65,0.7 6.8,12.85 27.65,29.85 3.65,4.75 20,0.6 5.65,15.25 2.35,8.1 3.45,16.4 5,17.65 8.35,12.95 6.95,14.55 4.8,1.75 1.7,19.85 2.9,7.05 4.4,13.95 1.8,3.55 5.05,9.3 4.55,2.95 26.8,23.85 12.4,5.75 14.65,21.85 20.7,21.9 22.55,37.8 22.55,36.65 14.65,36.7 17.15,25.2 24.3,20.35 30.8,18.45 30.1,18.45 30.1,19.25 30.8,19.25 30.8,20.05 30.1,20.05 30.25,4.35 3.5,9 4.9,10.85 7.85,17.65 8.3,16.9 13.35,15.25 13.3,16.25 13.9,12.85 11.3,12.35 11.15,11.1 10.2,11.2 10,12.35 8.6,11.85 17.7,10.35 25.15,28.25
  pour Top: 13.4,20.25 13,20.65 13,23 13.45,23.45 14.55,23.45 15.35,22.65 16.4,22.65 16.4,23.15 18.95,23.15 18.95,22.7 20.05,22.7 20.4,23.05 24.55,23.05 24.55,20.7 24.3,20.45 20.7,20.45 20.05,21.1 19,21.1 18.95,21.05 18.95,20.6 16.4,20.6 16.4,21.1 15.2,21.1 14.35,20.25
  pour Top: 24.5,20.65 24.6,20.55 24.6,16.7 26.2,15.1 34,15.1 34,28.2 29.95,28.2 28.55,26.8 28.55,26.35 27.85,26.35 24.5,23
  pour Top: 24.65,15.4 25.3,16.05 25.75,16.05 26.35,15.45 34,15.45 34,1.85 32.15,0 14.1,0 13.75,0.35 13.75,3.75 13.45,4.05 12.65,4.05 12.2,4.5 12.2,5.4 11.4,6.2 9.55,6.2 9.55,6.6 11.15,6.6 11.35,6.8 11.35,7.1 11.5,7.25 12.35,7.25 12.75,7.65 12.75,12.9 12.9,13.05 12.9,17.85 13.65,18.6 16.55,18.6 16.85,18.9 16.85,20.9 17.25,20.9 17.25,18.9 17.35,18.8 18.8,18.8 19.85,17.75 19.85,16.9 21.35,15.4
  pour Top: 29.5,27.8 29.05,28.25 21,28.25 20.25,29 17.6,29 17.35,28.75 17.35,27.6 17.65,27.3 17.65,26.7 17.9,26.45 18.5,26.45 18.65,26.3 18.65,25.15 18.55,25.05 18.55,23.7 16.85,23.7 16.85,24.8 16.75,24.9 16.1,24.9 13.9,27.1 0,27.1 0,40 2.05,42.05 19.95,42.05 23.4,38.6 23.4,35.15 24.1,34.45 24.25,34.45 24.65,34.05 24.65,33.6 25.05,33.2 34,33.2 34,27.9 33.9,27.8
  pour Top: 9.85,27.1 8.95,26.2 8.95,19.55 9.65,18.85 16.95,18.85 16.95,16.8 16.55,16.4 14.45,16.4 13.55,17.3 9.65,17.3 8.95,16.6 8.95,9.65 8.4,9.1 7.3,9.1 7.1,8.9 6,8.9 4.35,7.25 4.35,5.4 5.1,4.65 5.4,4.65 6.4,3.65 7.25,3.65 7.5,3.4 8.9,3.4 9.65,2.65 9.65,1.95 11.05,0.55 13.9,0.55 13.9,0 2,0 0,2 0,27.05 0.5,27.55 9.4,27.55
  pour Top: 23.35,36.55 24.5,37.7 24.9,37.7 25.25,37.7 26.05,36.9 26.35,36.6 26.35,33.65 27.05,32.95 29.85,32.95 33.7,32.95 34,33.25 34,38.55 34,40.05 32,42.05 20.25,42.05 20.05,41.85 20.05,39.85
  pour Top: 16.4,23.15 16.85,23.6 16.85,23.75 18.55,23.75 18.55,23.6 18.95,23.2 18.95,23.05 16.4,23.05
  pour Top: 16.85,19.9 16.45,20.3 16.45,20.65 17.95,20.65 17.95,20.6 17.25,19.9
  pour Route2: -0.7,42.5 34.8,42.5 34.8,39.15 34.8,-0.45 30.9,-0.45 -0.7,-0.45
  pour Bottom: -0.55,42.55 34.5,42.55 34.5,36.9 34.5,-0.2 -0.55,-0.2 -0.55,42.5
  pour Top: 24.75,27.2 24.75,28.3 25.3,28.3 25.3,27.15 24.8,27.15
  pour Top: 21.95,17.9 23.85,17.9 23.9,17.95 23.9,20.7 24.5,20.7 24.7,20.5 24.7,18.85 24.5,18.65 24.5,17.75 24.1,17.35 22.05,17.35 21.95,17.45
  pour Top: 8.25,13.2 13.1,13.2 13.1,10.6 8.55,10.6 8.25,10.9
INT_BMI  (via drill 0.2)
  Top 0.127: v29.75,28.25 29.4,27.9 U4.4
  Top 0.15: U2.34 18.64,11.19 v18.41,10.95
  Bottom 0.127: v18.41,10.95 15.7,10.95 14.7,11.95 14.7,14.95 15.09,15.35 15.09,15.76 14.7,16.15 13.78,17.07 11.61,17.07 11.49,17.19 9.56,17.19 9.17,17.58 8.83,17.58 8.38,18.03 8.38,18.47 7.74,19.11 7.74,25.94 9.44,27.64 14.16,27.64 15.83,25.97 22.32,25.97 22.65,26.3 24.9,26.3 26.85,28.25 v29.75,28.25
LED1  (via drill 0.2)
  Top 0.15: U2.22 20.98,16.32 v20.88,16.41 | v28,16.18 28.23,16.41 28.67,16.84 R8.1
  Bottom 0.15: v28,16.18 27.98,16.2 26.95,16.2 26.4,15.65 24.93,15.65 24.64,15.36 22.46,15.36 22.28,15.54 21.75,15.54 v20.88,16.41
LED2  (via drill 0.2)
  Top 0.15: U2.24 20.02,15.7 v18.6,15.7 | v28,15.4 28.4,15.4 28.69,15.69 R7.1
  Bottom 0.15: v18.6,15.7 20.9,15.7 21.33,15.27 22.16,15.27 22.35,15.08 24.76,15.08 25.02,15.35 26.6,15.35 26.75,15.5 27.9,15.5 v28,15.4
LED3  (via drill 0.2, 0.3)
  Top 0.127: v12.85,9.25 13.87,9.25 14.16,9.54 14.62,9.54 14.71,9.45 15.7,9.45 v15.8,9.55
  Top 0.15: U2.36 18.89,9.85 v18.89,9.56 | R5.1 22.89,4.04 v22.8,4.04
  Bottom 0.127: v15.8,9.55 15.86,9.61 18.84,9.61 v18.89,9.56
  Bottom 0.15: v22.8,4.04 20.84,4.04 19.2,2.4 18.05,2.4 17.75,2.7 17.75,3.3 18.15,3.7 18.25,3.7 18.25,5.2 18,5.45 16.25,5.45 16.11,5.31 14.04,5.31 13.11,6.24 13.11,6.34 12.52,6.93 12.52,8.91 v12.85,9.25
LED4  (via drill 0.2)
  Top 0.127: R6.1 23.4,3.55 v22.85,3 | v6.55,17.8 7.1,18.35 v9.15,18.35
  Top 0.15: U2.15 23.78,16.06 23.45,16.38 23.45,16.68 22.98,17.15 v22.93,17.15
  Bottom 0.127: v22.85,3 20.3,3 18.54,1.24 17.89,1.24 17.85,1.2 14.05,1.2 13.3,1.94 13.25,1.94 11.9,3.29 11.9,13.2 11.1,14 9.6,14 6.6,17 6.6,17.75 v6.55,17.8 | v9.15,18.35 9.78,17.72 11.71,17.72 11.83,17.6 20.19,17.6 20.33,17.74 22.16,17.74 22.75,17.15 v22.93,17.15
LED5  (via drill 0.2)
  Top 0.127: v13.45,31.45 12.55,31.45 R12.1
  Top 0.15: U$1.16 21.3,27.98 21.18,27.86 21.18,27.85 v20.95,27.62
  Bottom 0.127: v20.95,27.62 20.8,27.48 16.43,27.48 13.45,30.45 13.45,30.6 v13.45,31.45
LED6  (via drill 0.2)
  Top 0.127: R13.1 v14.39,30.26 v14.4,30.25
  Top 0.15: U$1.17 21.7,27.62 v21.68,27.6
  Bottom 0.127: v14.4,30.25 14.4,30.05 16.65,27.8 20.43,27.8 20.75,28.12 21.16,28.12 v21.68,27.6
N$1
  Top 0.15: U$1.2 18.92,33.18 16.54,35.56 16.54,35.7 | 16.54,35.7 X1.2 | C1.1 16.36,35.88 16.54,35.7
N$2
  Top 0.15: U$1.3 18.52,32.78 18.05,33.25 X1.1 16.46,33.17 C2.1
N$3
  Top 0.15: U$1.35 25.59,33.18 25.83,33.41 25.83,33.43 25.9,33.5 25.9,36.05 25.73,36.23 | 25.73,36.23 Y1.3 | C3.1 25.73,36.28 25.73,36.23
N$4
  Top 0.15: U$1.34 25.59,32.78 26.2,33.39 26.2,34.7 27.36,35.86 Y1.1 29.42,36.7 C4.1
N$5
  Top 0.2: U$1.1 18.96,33.92 18.91,33.92 18.36,34.47 C5.2
N$6
  Top 0.3: U$1.30 26.23,31.18 C8.2
  Top 0.36: L1.1 C8.2
N$7
  Top 0.15: C13.1 21.39,5.96 Y2.3 23.01,7.58 23.01,9.61 U2.44
N$8
  Top 0.15: C12.1 24.8,6.83 Y2.1 23.82,8.22 23.78,8.27 23.69,8.27 23.38,8.58 U2.45
N$9
  Top 0.2: U$1.47 L3.2
N$10
  Top 0.2: L3.1 20.61,37.61 L5.2
N$11
  Top 0.2: L5.1 21.5,36.51 C10.1 21.5,35.43 20.9,34.83 U$1.46
N$12
  Top 0.15: U2.12 27.6,17.06 27.6,17.5 | 27.6,17.5 X2.2 | C15.1 27.73,17.62 27.6,17.5
N$13
  Top 0.15: U2.13 25.1,16.06 X2.1 25.1,19.29 C16.1
N$14
  Top 0.15: R4.1 25.04,8.57 C18.1 24.5,8.6 24.41,8.7 24.41,9.01 24.18,9.23 U2.47
N$15
  Top 0.2: U$1.33 25.32,32.4 25.65,32.4 25.9,32.65 26.95,32.65 C38.1
N$16
  Top 0.15: C17.2 25.93,7.79 R4.2 25.89,8.53 C18.2 25.95,8.7 25.55,9.1 24.97,9.1 24.64,9.42 24.64,9.57 U2.48
N$18
  Top 0.127: R5.2 25.52,4.7 D3.1
N$19
  Top 0.127: R7.2 31.09,15.69 D7.1
N$20
  Top 0.127: R8.2 31.09,16.84 D8.1
N$22
  Top 0.3: U2.2 26.34,10.79 L2.1
  Top 0.36: L2.1 27.14,10.77 C19.1
N$23  (via drill 0.2)
  Top 0.127: R21.1 18.8,1.35 18.15,0.7 v18.1,0.75 | v13.1,1.45 13.14,1.41 U9.8
  Top 0.15: R17.2 R21.1
  Bottom 0.127: v18.1,0.75 13.4,0.75 13.1,1.05 v13.1,1.45
N$24
  Top 0.127: R6.2 D2.1
N$25
  Top 0.127: D4.1 11.69,29.08 R10.2
N$26
  Top 0.127: D1.1 10.73,31.46 R12.2
N$27
  Top 0.127: R13.2 10.71,30.26 D5.1
N$28
  Top 0.36: C19.2 28.88,10.8 C20.2 30,10.78 J1.FEED
N$29
  Top 0.15: R20.2 13.34,8.21 U11.1
N$30
  Top 0.15: R9.2 16.17,8.48 U7.1
N$31
  Top 0.127: D9.1 11.68,27.88 R18.2
N$32
  Top 0.127: R16.1 19.11,27.01 R14.1 19.12,26.48 18.9,26.25 18.9,24.37 U1.9
N$33
  Top 0.15: U8.1 30.16,22.81 31.61,22.81 X4.2
N$34
  Top 0.15: U8.2 30.55,23.41 X4.1
N$35
  Top 0.15: R22.2 10.94,1.21 11.73,0.42 12.9,0.42 13.23,0.75 14.1,0.75 14.35,1 U9.9
N$36
  Top 0.15: D6.1 20.18,4.69 R11.2
N$37
  Top 0.15: D10.1 20.18,3.54 R23.2
N$38
  Top 0.15: F1.2 S1.1
  pour Top: 9.15,13.4 9.15,16.5 9.75,17.1 12.7,17.1 12.7,13.4
NRESET  (via drill 0.2)
  Top 0.15: U5.7 7.2,34.45 7.3,34.55 U13.2 U13.9 9.4,34.55 v9.5,34.65 | v23.45,27.35 23.55,27.45 24.09,27.45 R1.1 24.5,27.64 U$1.24
  Bottom 0.15: v9.5,34.65 10.3,33.85 10.3,32.75 16.26,26.79 21.98,26.79 22.31,27.12 23.21,27.12 v23.45,27.36 v23.45,27.35
RFP1
  Top 0.36: L1.2 28.88,31.21 C9.2 J3.FEED
RST  (via drill 0.2, 0.3)
  Top 0.15: RESET.2 31.7,5.75 C25.1 31.68,6.51 R15.1 30.37,6.16 30.37,6.15 30.04,5.83 25.93,5.83 v25.8,5.7 | U11.3 14.51,8.93 v15,8.93 | U2.9 25.94,13.59 v26.2,13.85
  Bottom 0.127: 20.65,8.45 20.15,8.95 19.95,8.95 19.66,9.24 19.66,9.88 19.45,10.09 19.45,10.51 19.45,10.52 19.45,11.51 19.65,11.71 19.65,12.79 19.45,12.99 19.45,14.1 20.35,15 22.05,15 22.24,14.82 25.43,14.82 26.2,14.05 v26.2,13.85
  Bottom 0.15: 20.65,8.45 20.65,8.14 20.35,7.84 18.7,7.84 17.62,8.93 v15,8.93 14.19,8.12 14.19,6.69 14.49,6.39 15.66,6.39 15.91,6.65 18.7,6.65 20.2,5.15 22.33,5.15 22.34,5.15 23.25,5.15 23.26,5.15 25.25,5.15 v25.8,5.7
RTS
  Top 0.15: U11.2 14.89,7.5 15.89,7.5 15.94,7.55 15.94,7.4 | 15.94,7.4 R9.1 | U9.24 15.9,6 15.9,6.74 15.94,6.77 15.94,7.4
RX  (via drill 0.2)
  Top 0.15: U5.4 6.62,35.97 7.1,36.45 U14.5 U14.6 9.47,36.45 15.86,30.06 | U2.16 23.4,15.56 23.4,15.92 22.95,16.37 v22.95,16.42 | 15.86,30.06 15.94,29.98 U$1.10 | v13.75,27.15 15.85,29.25 15.85,29.46 15.86,29.47 15.86,30.06
  Bottom 0.15: v22.95,16.42 22.77,16.6 22.67,16.6 22.38,16.89 22.38,16.95 21.85,17.47 20.44,17.47 20.3,17.33 11.72,17.33 11.6,17.46 9.67,17.46 9.28,17.84 8.94,17.84 8.64,18.14 8.64,18.61 8.01,19.25 8.01,25.81 9.35,27.15 9.93,27.15 10.11,27.33 11.71,27.33 11.89,27.15 v13.75,27.15
RXD  (via drill 0.2)
  Top 0.15: U9.26 14.85,6.75 v14.7,6.9 | U2.40 21.38,9.12 21.27,9.01 21.27,9 v21.04,8.78
  Bottom 0.15: v21.04,8.78 20.95,8.69 20.95,7.94 20.58,7.57 15.27,7.57 14.7,7 v14.7,6.9
RXD_LED
  Top 0.15: D10.2 18.92,3.53 18.77,3.68 U9.18
SCK/CLK  (via drill 0.2)
  Top 0.15: U2.31 18.39,12.39 v18.3,12.3 | v16.35,15.8 v16.36,15.8 16.36,17.66 U6.6
  Bottom 0.15: v18.3,12.3 18.36,12.36 18.36,12.57 17.48,13.44 17.48,14.06 16.34,15.21 16.34,15.79 v16.35,15.8
SCL  (via drill 0.2, 0.3)
  Top 0.127: v27.55,27.05 27.65,26.95 U4.13
  Top 0.15: U2.35 18.98,10.79 18.5,10.32 v18.5,10.22 | R3.1 29.39,21.99 | 29.39,21.99 30.23,21.15 31.3,21.15 31.81,20.64 U10.6 | U8.7 26.61,24.41 26.25,24.05 26.25,22.4 27,21.66 27.11,21.66 27.25,21.52 v27.72,21.52 28.92,21.52 29.39,21.99
  Bottom 0.127: v27.55,27.05 27.35,27.05 26.7,26.4
  Bottom 0.15: v18.5,10.22 18.5,10.34 18.91,10.74 18.91,11.74 19.11,11.94 19.11,12.57 18.11,13.56 18.11,14.28 17.77,14.63 17.77,16.07 18.76,17.06 20.41,17.06 20.55,17.2 21.41,17.2 22.69,15.91 24.41,15.91 24.64,16.14 24.64,16.66 24.1,17.2 24.1,19.21 26.59,21.7 | v27.72,21.52 27.4,21.52 27.21,21.7 26.59,21.7 | 26.59,21.7 25.9,22.39 25.9,24.61 26.7,25.41 26.7,26.4
SCL2  (via drill 0.2)
  Top 0.15: v14.6,15.55 15.36,14.79 U2.25
  Bottom 0.15: v14.6,15.55 12.95,13.9 12.95,10.29 13.66,9.59 13.66,8.91 13.05,8.3 13.05,7.15 13.64,6.56 13.64,6.46 14.26,5.84 15.89,5.84 16.11,6.07 18.48,6.07 19.25,5.3 19.27,5.3 19.97,4.6 22.56,4.6 22.57,4.6 23.02,4.6 23.03,4.6 23.59,4.6 E2.PAD
SCS/CMD
  Top 0.15: U6.1 13.87,11.41 15.29,12.84 19.38,12.84 U2.30
SDA  (via drill 0.2)
  Top 0.15: U2.38 20.55,9.61 20.55,9.16 20.05,8.65 v20.05,8.35 | U10.1 27.78,20.3 R2.1 27.73,20.41 27,21.15 v26.9,21.15 25.95,22.1 25.95,24.25 26.61,24.91 U8.6 28.15,25.48 U4.14
  Bottom 0.15: v20.05,8.35 19.39,9 19.39,9.77 19.18,9.98 19.18,10.62 19.19,10.63 19.19,11.62 19.39,11.82 19.39,12.68 18.44,13.63 18.44,14.6 18.09,14.94 18.09,15.99 18.89,16.78 20.53,16.78 20.67,16.92 21.29,16.92 22.58,15.64 24.53,15.64 24.92,16.02 24.92,16.77 24.4,17.29 24.4,19.11 26.44,21.15 v26.9,21.15
SDA2  (via drill 0.2)
  Top 0.15: U2.27 17.06,13.99 16.92,14.13 14.42,14.13 14.3,14.25 v14.2,14.25
  Bottom 0.15: v14.2,14.25 13.8,14.25 13.25,13.7 13.25,10.39 13.94,9.7 13.94,8.8 13.32,8.19 13.32,7.27 13.91,6.68 13.91,6.57 14.37,6.12 15.77,6.12 16.01,6.35 18.61,6.35 20.09,4.87 22.45,4.87 22.45,4.88 23.14,4.88 23.14,4.87 24.68,4.87 26.15,3.4 27.95,3.4 29.02,2.33 E3.PAD
SDI/SD1  (via drill 0.2)
  Top 0.15: v17.18,12 17.64,11.54 17.95,11.54 18.03,11.47 18.67,11.47 18.8,11.59 U2.33 | v17.15,16.55 17.55,16.95 17.55,17.59 U6.5
  Bottom 0.15: v17.15,16.55 16.29,16.55 15.82,16.08 15.82,15.24 17.16,13.9 17.16,12.03 v17.18,12
SDO/SD0
  Top 0.15: U6.2 15.04,10.61 15.04,11.9 15.64,12.51 17.49,12.51 17.69,12.31 17.69,12.2 18.09,11.79 18.61,11.79 18.8,11.99 U2.32
SHD/SD2  (via drill 0.2)
  Top 0.15: v15.15,16.4 15.13,16.41 U6.7 | U2.28 17.07,13.59 16.81,13.85 16.27,13.85 v15.82,13.4
  Bottom 0.15: v15.82,13.4 15.82,14.75 15.41,15.16 15.41,15.81 15.15,16.07 v15.15,16.4
SWDCLK  (via drill 0.2)
  Top 0.15: U5.8 6.83,33.97 7.25,33.55 U13.4 U13.7 9.4,33.55 v9.5,33.45 | U$1.25 25.63,28.85 v26.05,28.85
  Bottom 0.15: v9.5,33.45 9.5,33.41 10.01,32.91 10.01,32.59 16.08,26.52 22.1,26.52 22.42,26.84 24.68,26.84 26.05,28.22 v26.05,28.85
SWDIO  (via drill 0.2)
  Top 0.15: U5.9 6.74,33.46 7.15,33.05 U13.5 U13.6 9.15,33.05 v9.5,32.7 | v26.1,29.6 26.08,29.58 U$1.26
  Bottom 0.15: v26.1,29.6 26.15,29.55 26.15,29.46 26.55,29.06 26.55,28.64 26.33,28.41 26.33,28.1 24.79,26.57 22.54,26.57 22.21,26.24 15.96,26.24 v9.5,32.7
SWO  (via drill 0.2)
  Top 0.15: U5.6 7.19,34.96 7.28,35.05 U13.1 U13.10 9,35.05 v9.4,35.45 | v22.65,27.62 22.73,27.7 23.09,27.7 23.3,27.91 U$1.21
  Bottom 0.15: v9.4,35.45 9.7,35.16 9.71,35.16 10.6,34.26 10.6,32.9 16.43,27.07 21.87,27.07 22.2,27.4 22.43,27.4 v22.65,27.62
SWP/SD3  (via drill 0.2)
  Top 0.15: U2.29 16.7,13.19 v16.55,13.35 | v15.6,11.75 15.6,11.31 U6.3
  Bottom 0.15: v16.55,13.35 15.6,12.39 v15.6,11.75
TX  (via drill 0.2)
  Top 0.15: U5.3 6.61,36.45 7.1,36.95 U14.4 U14.7 9.45,36.95 15.62,30.78 v16.35,30.78 U$1.8 | U2.14 24.18,16.52 v24.03,16.52 | v14.35,26.7 14.35,27.35 16.25,29.25 v16.35,29.25
  Bottom 0.15: v16.35,29.25 v16.35,30.78 | v24.03,16.52 24.03,16.77 22.76,18.04 9.84,18.04 9.65,18.22 9.65,18.56 9.36,18.86 8.79,18.86 8.28,19.37 8.28,25.63 9.45,26.8 9.97,26.8 10.22,27.06 11.6,27.06 11.89,26.77 12.95,26.77 13.11,26.6 14.25,26.6 v14.35,26.7
TXD  (via drill 0.2)
  Top 0.15: U9.25 15.35,6.85 v15.43,6.93 | U2.41 v21.78,8.81 v21.77,8.8
  Bottom 0.15: v15.43,6.93 15.79,7.29 20.74,7.29 21.48,8.03 21.48,8.5 v21.77,8.79 v21.77,8.8
TXD_LED
  Top 0.15: D6.2 19.03,4.68 18.53,4.18 U9.19
VBUS
  Top 0.15: F1.1 10.9,7.48 U12.10 U12.1 9.1,7.4 8.73,7.77 J4.A4 7.42,7.77 7.17,7.52 J4.B9
  pour Top: 8.4,7.65 8.85,7.2 11,7.2 11.45,7.65 12.25,7.65 12.4,7.8 12.4,10.4 9.15,10.4 9.15,8.5 8.55,7.9 8.4,7.9
  pour Top: 8.4,4.6 7.6,4.6 7.35,4.85 5.2,4.85 4.55,5.5 4.55,7.2 5,7.65 7.1,7.65 7.4,7.95 8.55,7.95 8.6,7.9 8.6,7.7 8.5,7.6 7.65,7.6 7.4,7.35 6.35,7.35 6,7 6,5.5 6.3,5.2 7.4,5.2 7.7,4.9 8.4,4.9
VDD  (via drill 0.2, 0.3)
  Top 0.127: 9.85,37.95 v10.6,37.2
  Top 0.15: C30.1 11.94,2.34 | 11.94,2.34 12.04,2.34 12.2,2.18 U9.7 U9.6 | 11.94,2.34 11.05,2.34 R22.1 | U2.19 22.18,16.71 C14.2 22.05,16.89 21.5,16.89 21.11,17.27 C22.2 | U2.43 22.58,8.82 v22.5,8.75 | U1.7 21.47,19.81 C36.1 23.01,19.65 C34.1 | C39.1 C37.1 21.36,23.93 U1.8 | 5.9,36.96 U5.2 | R15.2 28.09,6.51 v28.05,6.55
  Top 0.2: U$1.48 19.26,35.22 C6.2 19.26,35.19 19.55,34.9 v19.15,34.5 | C33.1 18.29,28.38 U$1.13 | U2.46 23.79,8.84 23.85,8.78 v23.9,8.78 | C24.2 19.14,8.86 | U2.37 19.92,9.64 19.14,8.86 | U4.5 28.12,28.09 C40.1 28.18,29.15 v28.9,29.15 | R3.2 28.49,22 27.92,22.57 | 27.92,22.57 U8.10 26.89,22.91 C27.1 | 27.92,22.57 27.6,22.25 v27.45,22.25 | U10.5 32.7,19.31 C11.1 32.77,20.13 v32.75,20.15 | U2.3 U2.4 25.36,11.59 25.37,11.6 25.77,11.6 26.25,12.07 C28.1 26.82,12.6 v27.05,12.6 | U2.1 25.33,9.78 v25.2,9.65 | 9.85,37.95 U14.9 U14.2 7.81,37.88 7.51,37.88 6.59,36.96 5.9,36.96 | C29.1 9.87,37.94 v10.6,37.2 | R10.1 12.56,28.9 v13.3,28.16 | E1.PAD 23.22,1.63 22.05,2.81 R23.1 R11.1 | 19.14,8.86 18.49,8.86 v18.25,9.1 | R2.2 26.35,20.35 v26.1,20.1
  Route15 0.2: v28.9,29.15 27.7,27.95 27.55,27.95
  other vias: 25.1,24.85 24.15,23.9 24.25,24.75 24.55,25.55 23.7,25.4 22.8,25.35 21.9,25.35 20.95,25.35 25.5,25.65 20.35,18.6 22.3,18.6 21.3,18.6 23.25,18.55 25.15,35 24.75,35.7 11.15,3.25 10.4,3.2 10.15,2.55 25.25,34.2 20.5,23.8 20.5,24.6 20.5,19.55 19.35,28.45
  pour Top: 20.65,16.75 20.65,17.45 19.5,18.6 19.5,20.6 20.15,20.6 20.55,20.2 23.75,20.2 23.75,18.1 21.85,18.1 21.6,17.85 21.6,16.8 21.55,16.75
  pour Top: 19.5,23.15 19.5,24.8 19.25,25.05 19.25,26.2 19.65,26.6 19.65,27.25 19.3,27.6 17.65,27.6 17.6,27.65 17.6,28.65 17.8,28.85 19.95,28.85 20.2,28.6 20.2,27.9 20.85,27.25 22.2,27.25 22.6,26.85 25.25,26.85 25.45,27.05 25.45,27.85 25.65,28.05 26.75,28.05 26.8,28 26.8,27.75 26.2,27.75 26.05,27.6 26.05,25.1 24.35,23.4 20.2,23.4 19.95,23.15
  pour Top: 25,33.5 25,34.5 24.65,34.85 24,34.85 23.65,35.2 23.65,35.6 23.95,35.9 23.95,36.1 23.85,36.2 23.85,36.45 24.2,36.8 24.5,36.8 24.75,36.55 24.75,36.2 25.6,35.35 25.6,33.5
  pour Top: 10.95,2.15 9.9,2.15 9.8,2.25 9.8,3.15 10.25,3.6 11.5,3.6 12.3,2.8 13.5,2.8 13.5,2.1 11,2.1
  pour Top: 21.5,17.4 21.75,17.15 22.45,17.15 22.45,16.1 22.3,15.95 22.25,15.9 22.1,15.9 21.25,16.75 21.25,17.2 21.45,17.4
  pour Top: 26,25.05 26.45,25.5 26.8,25.5 27.3,26 27.3,26.1 27.25,26.15 27.05,26.15 26.9,26 26.25,26 26.2,25.95 25.95,25.95 25.95,25.1
  pour Route15: -0.5,42.75 34.1,42.75 34.1,37.05 30.85,37.05 25.25,31.45 25.25,30.95 29.85,26.35 34,26.35 34,15.4 33.95,15.35 28.5,15.35 24.8,11.65 24.8,10.4 29.45,5.75 33.95,5.75 33.95,-0.15 -0.5,-0.15
  pour Route15: 25.4,12.4 27.25,12.4 27.35,12.5 27.35,13.8 27.05,14.1 25.4,12.45
VDD_SDIO  (via drill 0.2)
  Top 0.127: C21.1 11.23,18.6 v10.6,18.6 | v12.75,26.25 12.54,26.45 R18.1
  Top 0.254: C21.1 13.69,17.54 U6.8 13.87,15.5 14.91,14.46 17.06,14.46 17.13,14.39 U2.26
  Bottom 0.127: v10.6,18.6 9.95,19.25 9.05,19.25 8.55,19.75 8.55,25.5 9.55,26.5 10.04,26.5 10.33,26.79 11.49,26.79 11.78,26.5 12.5,26.5 v12.75,26.25

### Text on the board
tPlace: MESH | ACTV | PWR | MEM | CPU0 | CPU1 | IP | C | TX | RX